# EAGLE design fc-nes (EAGLE 6.4)

## Sheet 1 of 3
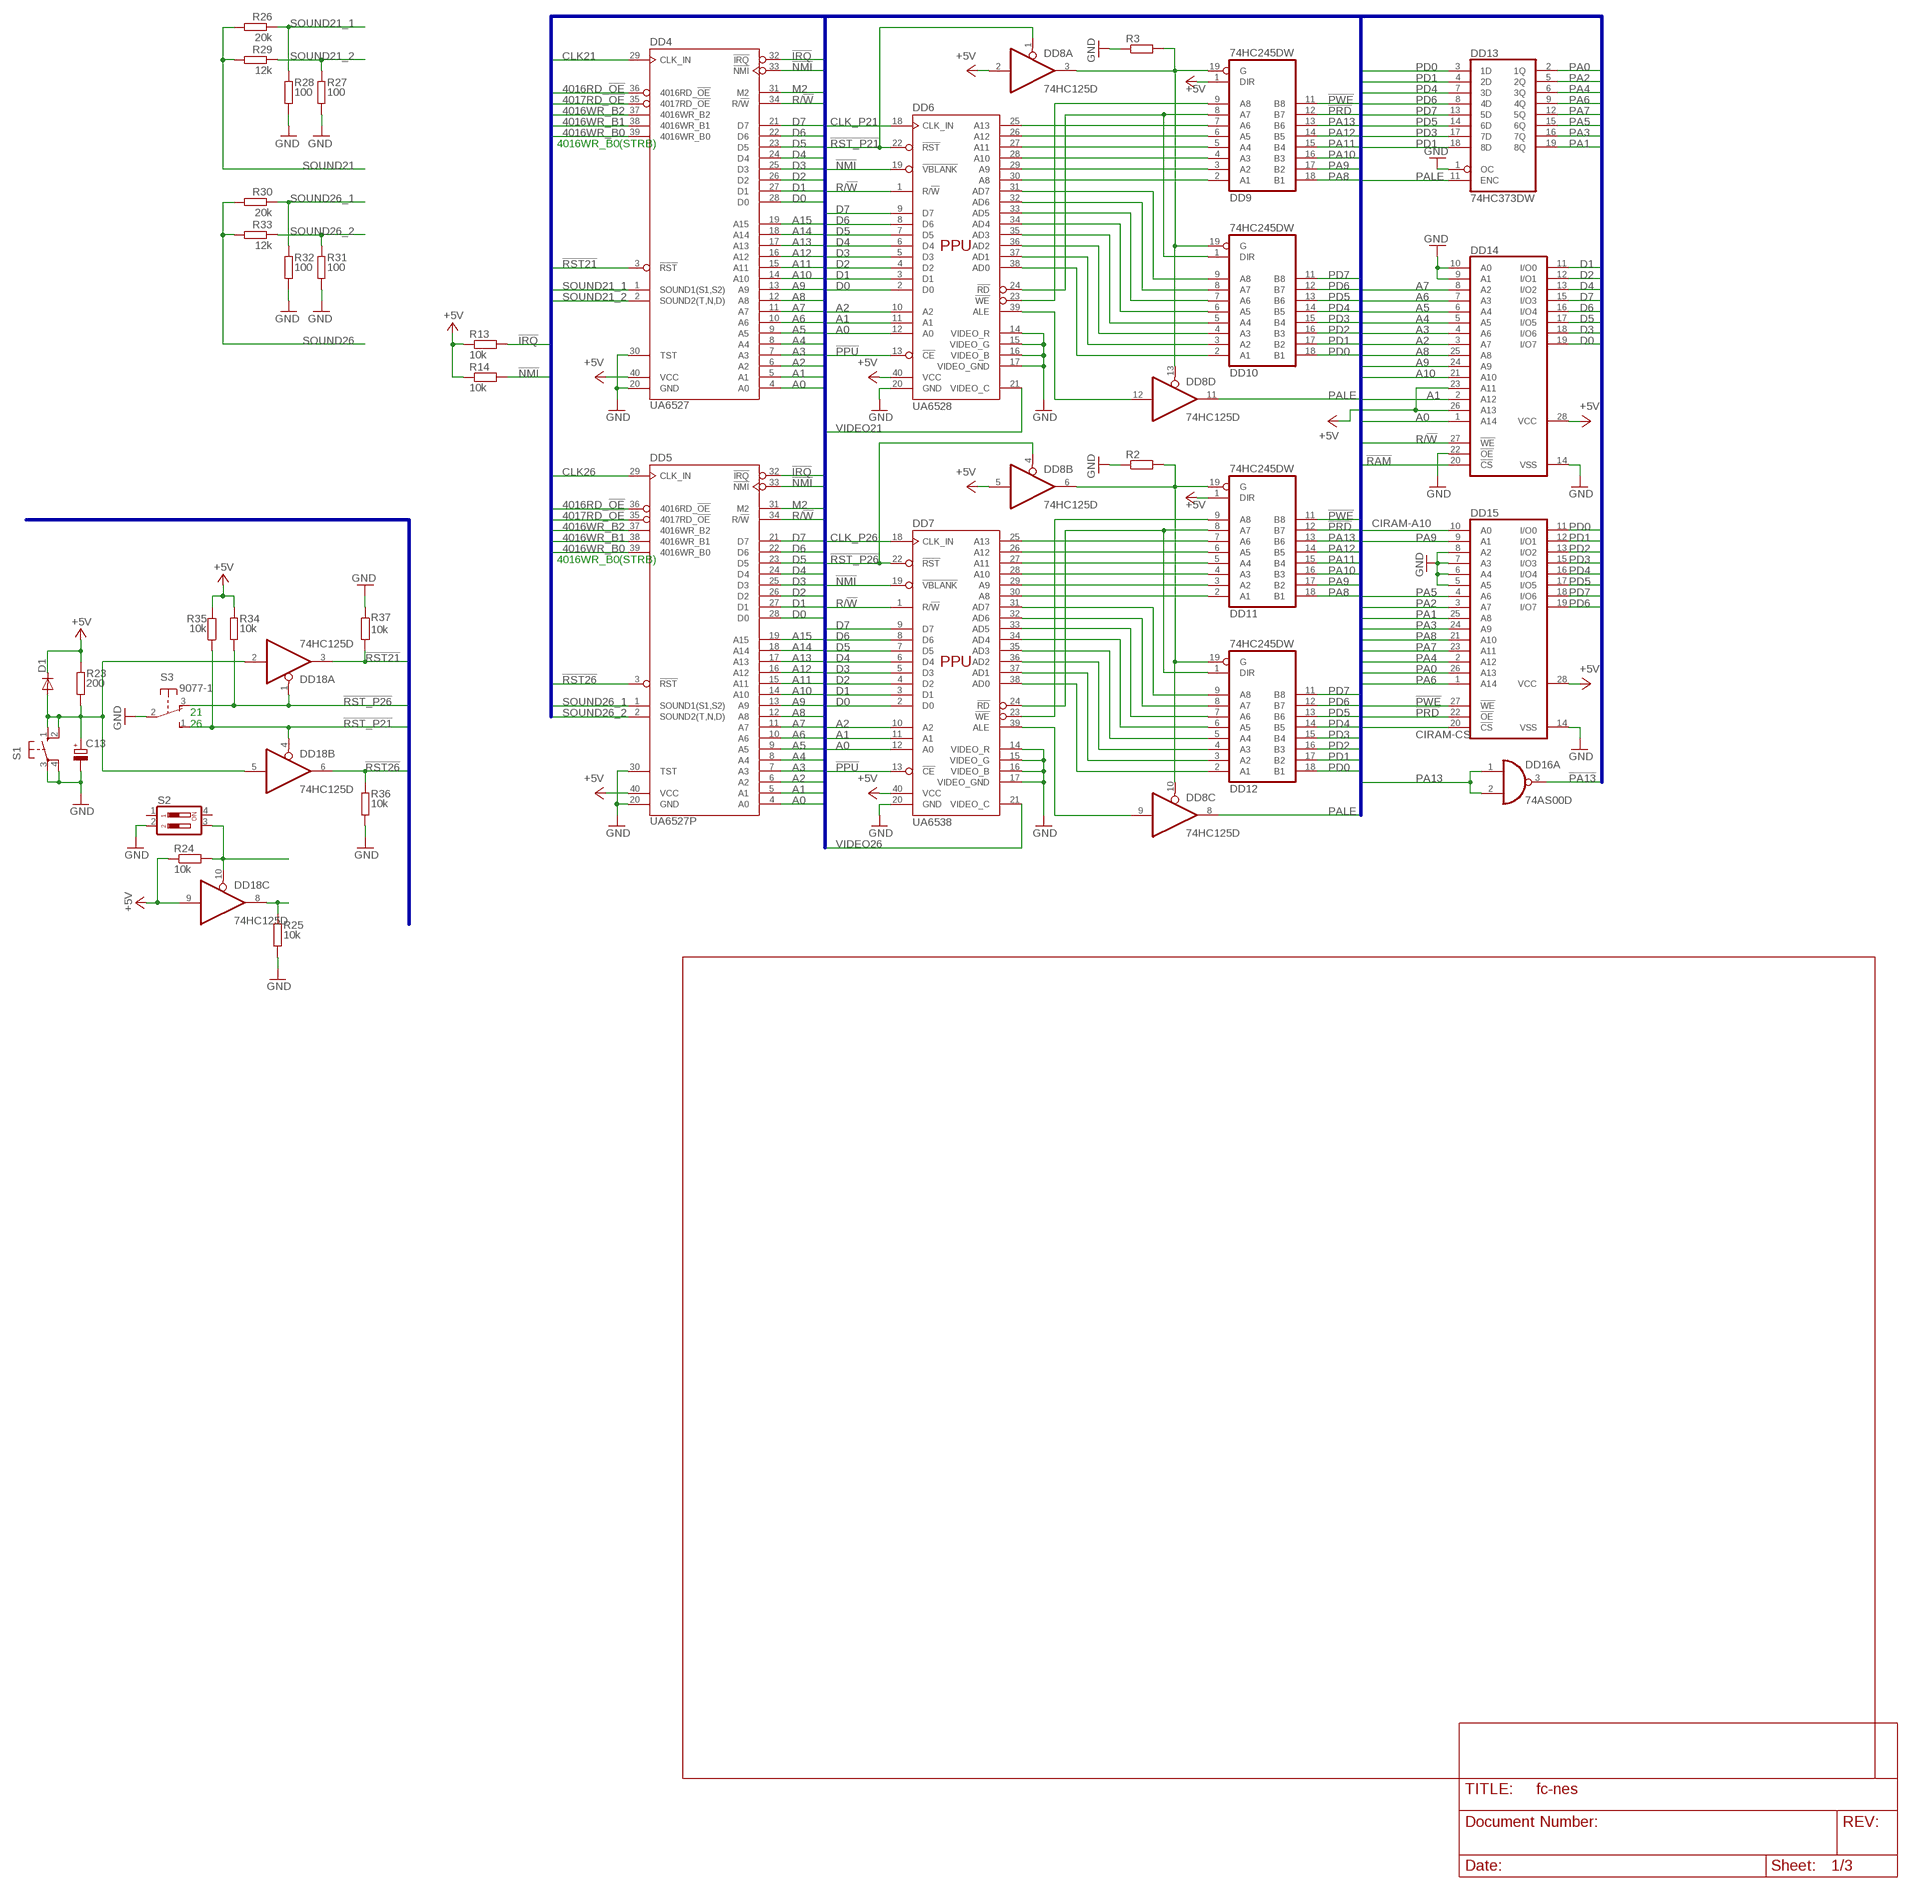
[diagram p0: schematic, sheet 1]

### Parts
C13  CPOL-EUSMCA  [SMC_A]
D1  DIODE-SOD80C  [SOD80C]
DD4  UA6527  [DIL40]
DD5  UA6527P  UA6527  [DIL40]
DD6  UA6528  UA6538  [DIL40]
DD7  UA6538  [DIL40]
DD8  74HC125D  [SO14]
DD9  74HC245DW  [SO20W]
DD10  74HC245DW  [SO20W]
DD11  74HC245DW  [SO20W]
DD12  74HC245DW  [SO20W]
DD13  74HC373DW  [SO20W]
DD14  62256S  [DIL28-6S]
DD15  62256S  [DIL28-6S]
DD16  74AS00D  [SO14]
DD18  74HC125D  [SO14]
R2  R-EU_M0805  [M0805]
R3  R-EU_M0805  [M0805]
R13  10k  R-EU_M0805  [M0805]
R14  10k  R-EU_M0805  [M0805]
R23  200  R-EU_M0805  [M0805]
R24  10k  R-EU_M0805  [M0805]
R25  10k  R-EU_M0805  [M0805]
R26  20k  R-EU_M0805  [M0805]
R27  100  R-EU_M0805  [M0805]
R28  100  R-EU_M0805  [M0805]
R29  12k  R-EU_M0805  [M0805]
R30  20k  R-EU_M0805  [M0805]
R31  100  R-EU_M0805  [M0805]
R32  100  R-EU_M0805  [M0805]
R33  12k  R-EU_M0805  [M0805]
R34  10k  R-EU_M0805  [M0805]
R35  10k  R-EU_M0805  [M0805]
R36  10k  R-EU_M0805  [M0805]
R37  10k  R-EU_M0805  [M0805]
S1  10-XX  [B3F-10XX]
S2  DIP02YL  [DIP02YL]
S3  9077-1  [9077-1]

### Nets
4016RD_!OE: DD4.36(4016RD_!OE) DD5.36(4016RD_!OE) ; also sheet 2
4016WR_B0: DD4.39(4016WR_B0) DD5.39(4016WR_B0) ; also sheet 2
4016WR_B1: DD4.38(4016WR_B1) DD5.38(4016WR_B1) ; also sheet 2
4016WR_B2: DD4.37(4016WR_B2) DD5.37(4016WR_B2) ; also sheet 2
4017RD_!OE: DD4.35(4017RD_!OE) DD5.35(4017RD_!OE) ; also sheet 2
!IRQ: DD4.32(!IRQ) DD5.32(!IRQ) R13.2 ; also sheet 2
!NMI: DD4.33(!NMI) DD5.33(!NMI) DD6.19(!VBLANK) DD7.19(!VBLANK) R14.2
!PA13: DD16.3(A:O) ; also sheet 2
!PPU: DD6.13(!CE) DD7.13(!CE) ; also sheet 2
!PRD: DD9.12(B7) DD11.12(B7) DD15.22(!OE) ; also sheet 2
!PWE: DD9.11(B8) DD11.11(B8) DD15.27(!WE) ; also sheet 2
!RAM: DD14.20(!CS) ; also sheet 2
!RST21: DD4.3(!RST) DD18.3(A:O) R37.2
!RST26: DD5.3(!RST) DD18.6(B:O) R36.2
!RST_P21: DD6.22(!RST) DD8.1(A:OE) DD18.4(B:OE) R35.1 S3.1(S)
!RST_P26: DD7.22(!RST) DD8.4(B:OE) DD18.1(A:OE) R34.1 S3.3(O)
+5V: D1.C DD4.40(VCC) DD5.40(VCC) DD6.40(VCC) DD7.40(VCC) DD8.2(A:I) DD8.5(B:I) DD9.1(DIR) DD11.1(DIR) DD14.23(A11) DD14.26(A13) DD14.28(VCC) DD15.28(VCC) DD18.9(C:I) R13.1 R14.1 R23.2 R24.1 R34.2 R35.2 ; also sheet 2,3
A0: DD4.4(A0) DD5.4(A0) DD6.12(A0) DD7.12(A0) DD14.1(A14) ; also sheet 2
A1: DD4.5(A1) DD5.5(A1) DD6.11(A1) DD7.11(A1) DD14.2(A12) ; also sheet 2
A2: DD4.6(A2) DD5.6(A2) DD6.10(A2) DD7.10(A2) DD14.3(A7) ; also sheet 2
A3: DD4.7(A3) DD5.7(A3) DD14.4(A6) ; also sheet 2
A4: DD4.8(A4) DD5.8(A4) DD14.5(A5) ; also sheet 2
A5: DD4.9(A5) DD5.9(A5) DD14.6(A4) ; also sheet 2
A6: DD4.10(A6) DD5.10(A6) DD14.7(A3) ; also sheet 2
A7: DD4.11(A7) DD5.11(A7) DD14.8(A2) ; also sheet 2
A8: DD4.12(A8) DD5.12(A8) DD14.25(A8) ; also sheet 2
A9: DD4.13(A9) DD5.13(A9) DD14.24(A9) ; also sheet 2
A10: DD4.14(A10) DD5.14(A10) DD14.21(A10) ; also sheet 2
A11: DD4.15(A11) DD5.15(A11) ; also sheet 2
A12: DD4.16(A12) DD5.16(A12) ; also sheet 2
A13: DD4.17(A13) DD5.17(A13) ; also sheet 2
A14: DD4.18(A14) DD5.18(A14) ; also sheet 2
A15: DD4.19(A15) DD5.19(A15) ; also sheet 2
CIRAM-A10: DD15.10(A0) ; also sheet 2
CIRAM-CS: DD15.20(!CS) ; also sheet 2
CLK21: DD4.29(CLK_IN) ; also sheet 3
CLK26: DD5.29(CLK_IN) ; also sheet 3
CLK_P21: DD6.18(CLK_IN) ; also sheet 3
CLK_P26: DD7.18(CLK_IN) ; also sheet 3
D0: DD4.28(D0) DD5.28(D0) DD6.2(D0) DD7.2(D0) DD14.19(I/O7) ; also sheet 2
D1: DD4.27(D1) DD5.27(D1) DD6.3(D1) DD7.3(D1) DD14.11(I/O0) ; also sheet 2
D2: DD4.26(D2) DD5.26(D2) DD6.4(D2) DD7.4(D2) DD14.12(I/O1) ; also sheet 2
D3: DD4.25(D3) DD5.25(D3) DD6.5(D3) DD7.5(D3) DD14.18(I/O6) ; also sheet 2
D4: DD4.24(D4) DD5.24(D4) DD6.6(D4) DD7.6(D4) DD14.13(I/O2) ; also sheet 2
D5: DD4.23(D5) DD5.23(D5) DD6.7(D5) DD7.7(D5) DD14.17(I/O5) ; also sheet 2
D6: DD4.22(D6) DD5.22(D6) DD6.8(D6) DD7.8(D6) DD14.16(I/O4) ; also sheet 2
D7: DD4.21(D7) DD5.21(D7) DD6.9(D7) DD7.9(D7) DD14.15(I/O3) ; also sheet 2
GND: C13.- DD4.20(GND) DD4.30(TST) DD5.20(GND) DD5.30(TST) DD6.14(VIDEO_R) DD6.15(VIDEO_G) DD6.16(VIDEO_B) DD6.17(VIDEO_GND) DD6.20(GND) DD7.14(VIDEO_R) DD7.15(VIDEO_G) DD7.16(VIDEO_B) DD7.17(VIDEO_GND) DD7.20(GND) DD13.1(OC) DD14.9(A1) DD14.10(A0) DD14.14(VSS) DD14.22(!OE) DD15.5(A5) DD15.6(A4) DD15.7(A3) DD15.8(A2) DD15.14(VSS) R2.1 R3.1 R25.1 R27.1 R28.1 R31.1 R32.1 R36.1 R37.1 S1.3(P) S1.4(P1) S2.2 S3.2(P) ; also sheet 2,3
M2: DD4.31(M2) DD5.31(M2) ; also sheet 2
N$1: DD6.23(!WE) DD9.9(A8)
N$2: DD6.24(!RD) DD9.8(A7) DD10.1(DIR)
N$3: DD6.25(A13) DD9.7(A6)
N$4: DD6.26(A12) DD9.6(A5)
N$5: DD6.27(A11) DD9.5(A4)
N$6: DD6.28(A10) DD9.4(A3)
N$7: DD6.29(A9) DD9.3(A2)
N$8: DD6.30(A8) DD9.2(A1)
N$9: DD6.31(AD7) DD10.9(A8)
N$10: DD6.32(AD6) DD10.8(A7)
N$11: DD6.33(AD5) DD10.7(A6)
N$12: DD6.34(AD4) DD10.6(A5)
N$13: DD6.35(AD3) DD10.5(A4)
N$14: DD6.36(AD2) DD10.4(A3)
N$15: DD6.37(AD1) DD10.3(A2)
N$16: DD6.38(AD0) DD10.2(A1)
N$17: DD8.3(A:O) DD8.13(D:OE) DD9.19(G) DD10.19(G) R3.2
N$18: DD6.39(ALE) DD8.12(D:I)
N$20: DD7.23(!WE) DD11.9(A8)
N$21: DD7.24(!RD) DD11.8(A7) DD12.1(DIR)
N$22: DD7.25(A13) DD11.7(A6)
N$23: DD7.26(A12) DD11.6(A5)
N$24: DD7.27(A11) DD11.5(A4)
N$25: DD7.28(A10) DD11.4(A3)
N$26: DD7.29(A9) DD11.3(A2)
N$27: DD7.30(A8) DD11.2(A1)
N$28: DD7.31(AD7) DD12.9(A8)
N$29: DD7.32(AD6) DD12.8(A7)
N$30: DD7.33(AD5) DD12.7(A6)
N$31: DD7.34(AD4) DD12.6(A5)
N$32: DD7.35(AD3) DD12.5(A4)
N$33: DD7.36(AD2) DD12.4(A3)
N$34: DD7.37(AD1) DD12.3(A2)
N$35: DD7.38(AD0) DD12.2(A1)
N$36: DD8.6(B:O) DD8.10(C:OE) DD11.19(G) DD12.19(G) R2.2
N$38: DD7.39(ALE) DD8.9(C:I)
N$48: C13.+ D1.A DD18.2(A:I) DD18.5(B:I) R23.1 S1.1(S) S1.2(S1)
N$50: DD18.10(C:OE) R24.2 S2.3
N$53: DD18.8(C:O) R25.2
PA0: DD13.2(1Q) DD15.26(A13) ; also sheet 2
PA1: DD13.19(8Q) DD15.25(A8) ; also sheet 2
PA2: DD13.5(2Q) DD15.3(A7) ; also sheet 2
PA3: DD13.16(7Q) DD15.24(A9) ; also sheet 2
PA4: DD13.6(3Q) DD15.2(A12) ; also sheet 2
PA5: DD13.15(6Q) DD15.4(A6) ; also sheet 2
PA6: DD13.9(4Q) DD15.1(A14) ; also sheet 2
PA7: DD13.12(5Q) DD15.23(A11) ; also sheet 2
PA8: DD9.18(B1) DD11.18(B1) DD15.21(A10) ; also sheet 2
PA9: DD9.17(B2) DD11.17(B2) DD15.9(A1) ; also sheet 2
PA10: DD9.16(B3) DD11.16(B3) ; also sheet 2
PA11: DD9.15(B4) DD11.15(B4) ; also sheet 2
PA12: DD9.14(B5) DD11.14(B5) ; also sheet 2
PA13: DD9.13(B6) DD11.13(B6) DD16.1(A:I0) DD16.2(A:I1) ; also sheet 2
PALE: DD8.8(C:O) DD8.11(D:O) DD13.11(ENC)
PD0: DD10.18(B1) DD12.18(B1) DD13.3(1D) DD15.11(I/O0) ; also sheet 2
PD1: DD10.17(B2) DD12.17(B2) DD13.4(2D) DD13.18(8D) DD15.12(I/O1) ; also sheet 2
PD2: DD10.16(B3) DD12.16(B3) DD15.13(I/O2) ; also sheet 2
PD3: DD10.15(B4) DD12.15(B4) DD13.17(7D) DD15.15(I/O3) ; also sheet 2
PD4: DD10.14(B5) DD12.14(B5) DD13.7(3D) DD15.16(I/O4) ; also sheet 2
PD5: DD10.13(B6) DD12.13(B6) DD13.14(6D) DD15.17(I/O5) ; also sheet 2
PD6: DD10.12(B7) DD12.12(B7) DD13.8(4D) DD15.19(I/O7) ; also sheet 2
PD7: DD10.11(B8) DD12.11(B8) DD13.13(5D) DD15.18(I/O6) ; also sheet 2
R/!W: DD4.34(R/!W) DD5.34(R/!W) DD6.1(R/!W) DD7.1(R/!W) DD14.27(!WE) ; also sheet 2
SOUND21: R26.2 R29.2
SOUND21_1: DD4.1(SOUND1(S1,S2)) R26.1 R28.2
SOUND21_2: DD4.2(SOUND2(T,N,D)) R27.2 R29.1
SOUND26: R30.2 R33.2
SOUND26_1: DD5.1(SOUND1(S1,S2)) R30.1 R32.2
SOUND26_2: DD5.2(SOUND2(T,N,D)) R31.2 R33.1
VIDEO21: DD6.21(VIDEO_C)
VIDEO26: DD7.21(VIDEO_C)
Unconnected: DD16.4(B:I0) DD16.5(B:I1) DD16.6(B:O) DD16.8(C:O) DD16.9(C:I0) DD16.10(C:I1) DD16.11(D:O) DD16.12(D:I0) DD16.13(D:I1) DD18.11(D:O) DD18.12(D:I) DD18.13(D:OE) S2.1 S2.4

### Buses
A[0..15],D[0..7],PA[0..13],!PA13,PD[0..7],CLK21,CLK26,CLK_P21,CLK_P26,CIRAM-A10,CIRAM-CS,!IRQ,M2,!NMI,PALE,!PPU,!PRD,!PWE,!RAM,!ROMSEL,R/!W,!RST21,!RST26,!RST_P21,!RST_P26,4016CUP,4016RD_!OE,4016WR_B[0..2],4016RD_D[0..4],4017CUP,4017RD_!OE,4017RD_D[0..4],VIDEO21,VIDEO26,MIC,SND_IN,SND_OUT,SOUND21_[1..2],SOUND21,SOUND26_[1..2],SOUND26

### Notes on the sheet
- 4016WR_B0(STRB)
- 4016WR_B0(STRB)
- 21
  26

## Sheet 2 of 3
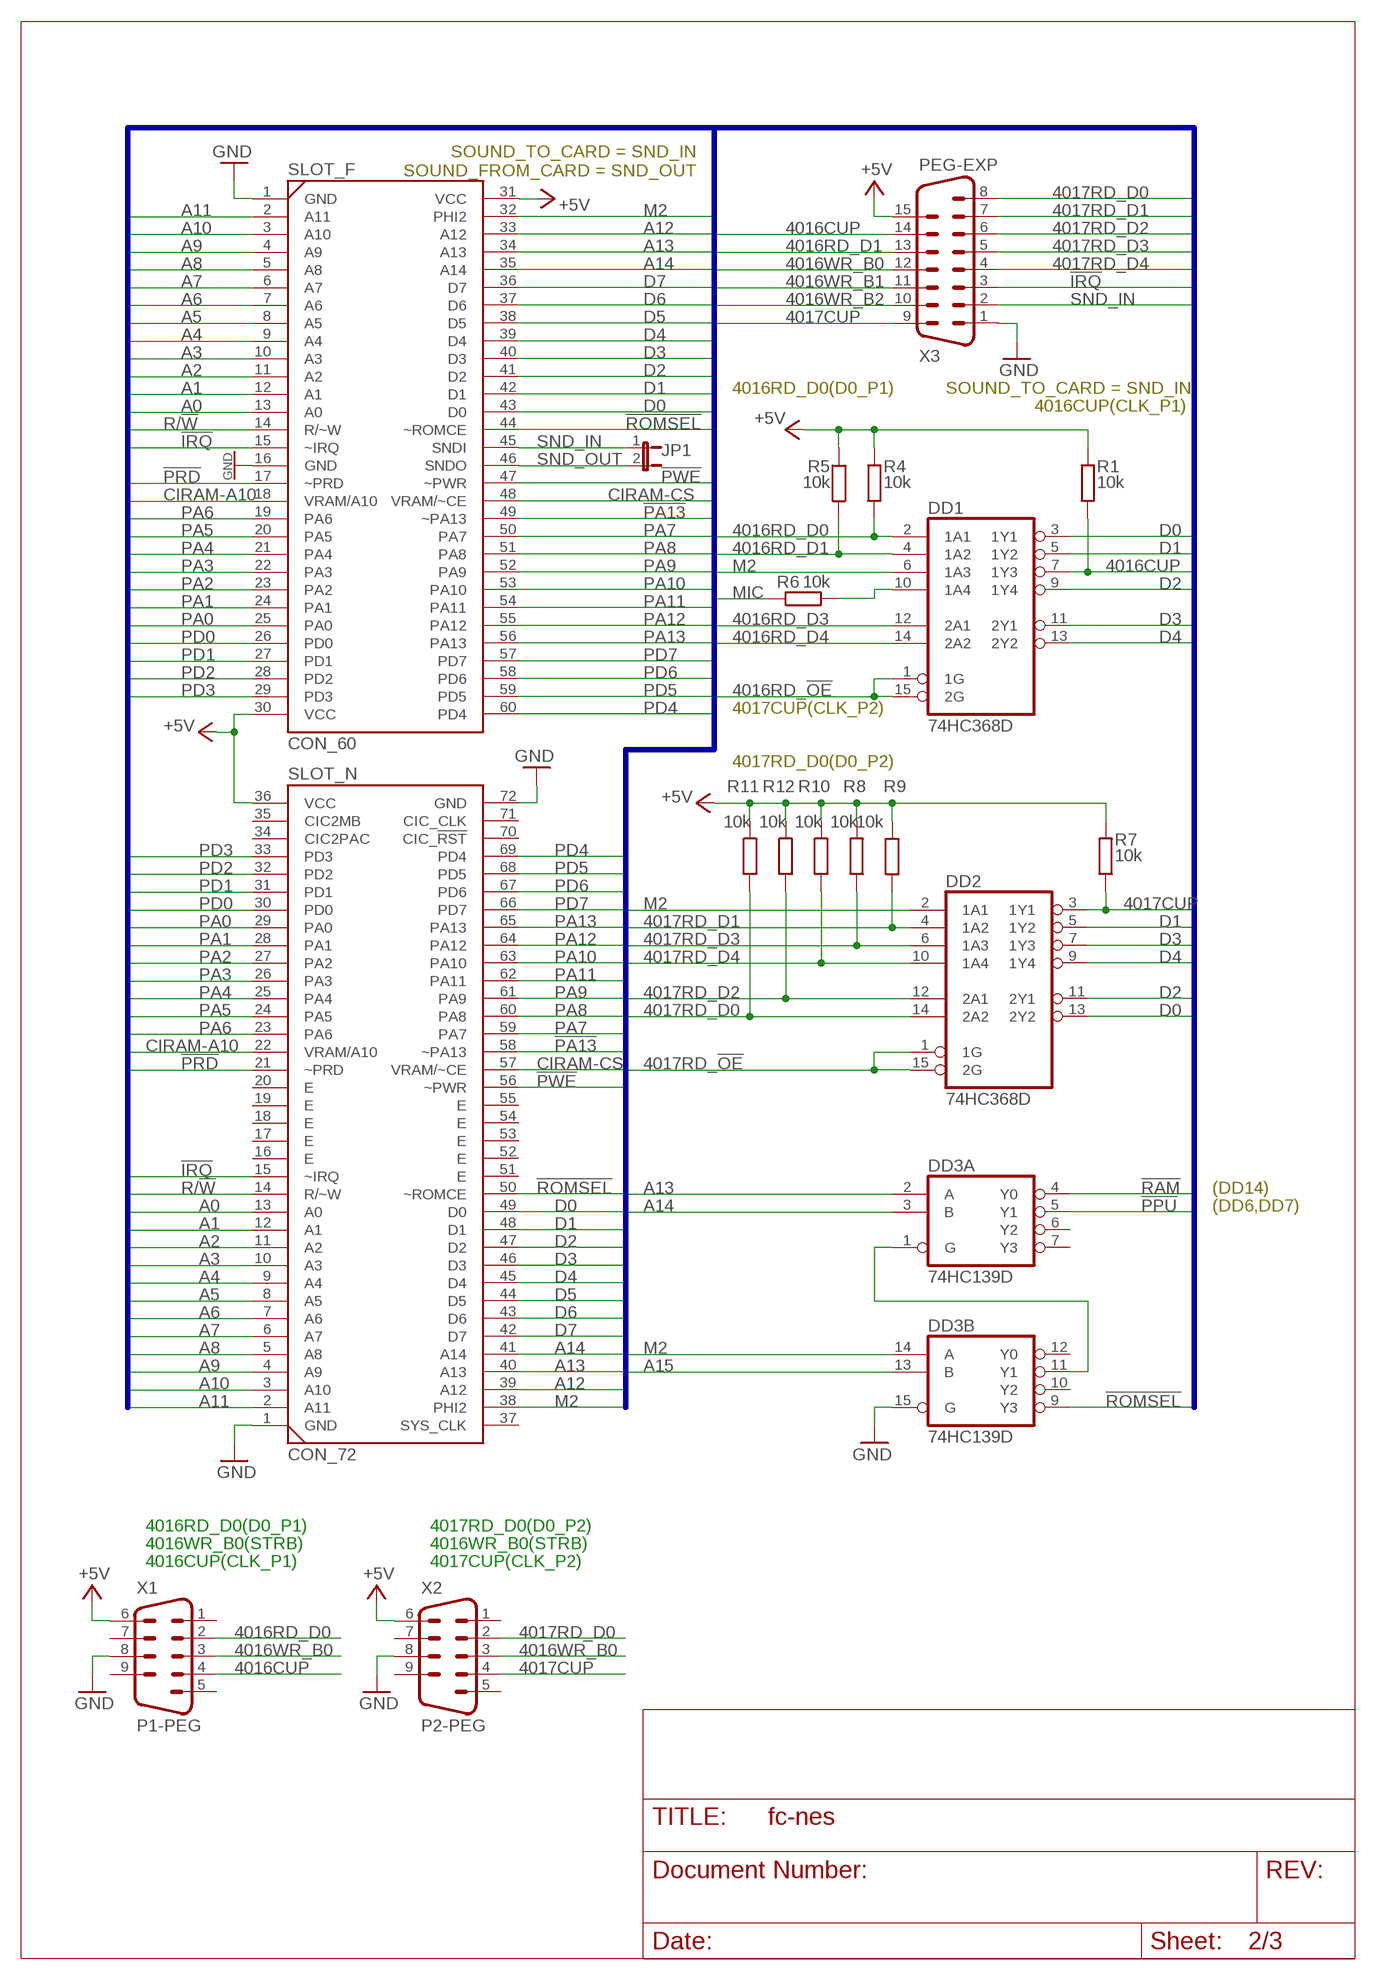
[diagram p1: schematic, sheet 2]

### Parts
DD1  74HC368D  [SO16]
DD2  74HC368D  [SO16]
DD3  74HC139D  [SO16]
JP1  JP1E  [JP1]
R1  10k  R-EU_M0805  [M0805]
R4  10k  R-EU_M0805  [M0805]
R5  10k  R-EU_M0805  [M0805]
R6  10k  R-EU_M0805  [M0805]
R7  10k  R-EU_M0805  [M0805]
R8  10k  R-EU_M0805  [M0805]
R9  10k  R-EU_M0805  [M0805]
R10  10k  R-EU_M0805  [M0805]
R11  10k  R-EU_M0805  [M0805]
R12  10k  R-EU_M0805  [M0805]
SLOT_F  CON_60  [CON_60]
SLOT_N  CON_72  [CON_72]
X1  P1-PEG  M09HP  [M09HP]
X2  P2-PEG  M09HP  [M09HP]
X3  PEG-EXP  M15HP  [M15HP]

### Nets
4016CUP: DD1.7(1Y3) R1.1 X1.4 X3.14
4016RD_!OE: DD1.1(1G) DD1.15(2G) ; also sheet 1
4016RD_D0: DD1.2(1A1) R4.1 X1.2
4016RD_D1: DD1.4(1A2) R5.1 X3.13
4016RD_D3: DD1.12(2A1)
4016RD_D4: DD1.14(2A2)
4016WR_B0: X1.3 X2.3 X3.12 ; also sheet 1
4016WR_B1: X3.11 ; also sheet 1
4016WR_B2: X3.10 ; also sheet 1
4017CUP: DD2.3(1Y1) R7.1 X2.4 X3.9
4017RD_!OE: DD2.1(1G) DD2.15(2G) ; also sheet 1
4017RD_D0: DD2.14(2A2) R11.2 X2.2 X3.8
4017RD_D1: DD2.4(1A2) R9.1 X3.7
4017RD_D2: DD2.12(2A1) R12.2 X3.6
4017RD_D3: DD2.6(1A3) R8.1 X3.5
4017RD_D4: DD2.10(1A4) R10.2 X3.4
!IRQ: SLOT_F.15(~IRQ) SLOT_N.15(~IRQ) X3.3 ; also sheet 1
!PA13: SLOT_F.49(~PA13) SLOT_N.58(~PA13) ; also sheet 1
!PPU: DD3.5(A:Y1) ; also sheet 1
!PRD: SLOT_F.17(~PRD) SLOT_N.21(~PRD) ; also sheet 1
!PWE: SLOT_F.47(~PWR) SLOT_N.56(~PWR) ; also sheet 1
!RAM: DD3.4(A:Y0) ; also sheet 1
!ROMSEL: DD3.9(B:Y3) SLOT_F.44(~ROMCE) SLOT_N.50(~ROMCE)
+5V: R1.2 R4.2 R5.2 R7.2 R8.2 R9.2 R10.1 R11.1 R12.1 SLOT_F.30(VCC) SLOT_F.31(VCC) SLOT_N.36(VCC) X1.6 X2.6 X3.15 ; also sheet 1,3
A0: SLOT_F.13(A0) SLOT_N.13(A0) ; also sheet 1
A1: SLOT_F.12(A1) SLOT_N.12(A1) ; also sheet 1
A2: SLOT_F.11(A2) SLOT_N.11(A2) ; also sheet 1
A3: SLOT_F.10(A3) SLOT_N.10(A3) ; also sheet 1
A4: SLOT_F.9(A4) SLOT_N.9(A4) ; also sheet 1
A5: SLOT_F.8(A5) SLOT_N.8(A5) ; also sheet 1
A6: SLOT_F.7(A6) SLOT_N.7(A6) ; also sheet 1
A7: SLOT_F.6(A7) SLOT_N.6(A7) ; also sheet 1
A8: SLOT_F.5(A8) SLOT_N.5(A8) ; also sheet 1
A9: SLOT_F.4(A9) SLOT_N.4(A9) ; also sheet 1
A10: SLOT_F.3(A10) SLOT_N.3(A10) ; also sheet 1
A11: SLOT_F.2(A11) SLOT_N.2(A11) ; also sheet 1
A12: SLOT_F.33(A12) SLOT_N.39(A12) ; also sheet 1
A13: DD3.2(A:A) SLOT_F.34(A13) SLOT_N.40(A13) ; also sheet 1
A14: DD3.3(A:B) SLOT_F.35(A14) SLOT_N.41(A14) ; also sheet 1
A15: DD3.13(B:B) ; also sheet 1
CIRAM-A10: SLOT_F.18(VRAM/A10) SLOT_N.22(VRAM/A10) ; also sheet 1
CIRAM-CS: SLOT_F.48(VRAM/~CE) SLOT_N.57(VRAM/~CE) ; also sheet 1
D0: DD1.3(1Y1) DD2.13(2Y2) SLOT_F.43(D0) SLOT_N.49(D0) ; also sheet 1
D1: DD1.5(1Y2) DD2.5(1Y2) SLOT_F.42(D1) SLOT_N.48(D1) ; also sheet 1
D2: DD1.9(1Y4) DD2.11(2Y1) SLOT_F.41(D2) SLOT_N.47(D2) ; also sheet 1
D3: DD1.11(2Y1) DD2.7(1Y3) SLOT_F.40(D3) SLOT_N.46(D3) ; also sheet 1
D4: DD1.13(2Y2) DD2.9(1Y4) SLOT_F.39(D4) SLOT_N.45(D4) ; also sheet 1
D5: SLOT_F.38(D5) SLOT_N.44(D5) ; also sheet 1
D6: SLOT_F.37(D6) SLOT_N.43(D6) ; also sheet 1
D7: SLOT_F.36(D7) SLOT_N.42(D7) ; also sheet 1
GND: DD3.15(B:G) SLOT_F.1(GND) SLOT_F.16(GND) SLOT_N.1(GND) SLOT_N.72(GND) X1.8 X2.8 X3.1 ; also sheet 1,3
M2: DD1.6(1A3) DD2.2(1A1) DD3.14(B:A) SLOT_F.32(PHI2) SLOT_N.38(PHI2) ; also sheet 1
MIC: R6.1
N$37: DD3.1(A:G) DD3.11(B:Y1)
N$40: DD1.10(1A4) R6.2
PA0: SLOT_F.25(PA0) SLOT_N.29(PA0) ; also sheet 1
PA1: SLOT_F.24(PA1) SLOT_N.28(PA1) ; also sheet 1
PA2: SLOT_F.23(PA2) SLOT_N.27(PA2) ; also sheet 1
PA3: SLOT_F.22(PA3) SLOT_N.26(PA3) ; also sheet 1
PA4: SLOT_F.21(PA4) SLOT_N.25(PA4) ; also sheet 1
PA5: SLOT_F.20(PA5) SLOT_N.24(PA5) ; also sheet 1
PA6: SLOT_F.19(PA6) SLOT_N.23(PA6) ; also sheet 1
PA7: SLOT_F.50(PA7) SLOT_N.59(PA7) ; also sheet 1
PA8: SLOT_F.51(PA8) SLOT_N.60(PA8) ; also sheet 1
PA9: SLOT_F.52(PA9) SLOT_N.61(PA9) ; also sheet 1
PA10: SLOT_F.53(PA10) SLOT_N.63(PA10) ; also sheet 1
PA11: SLOT_F.54(PA11) SLOT_N.62(PA11) ; also sheet 1
PA12: SLOT_F.55(PA12) SLOT_N.64(PA12) ; also sheet 1
PA13: SLOT_F.56(PA13) SLOT_N.65(PA13) ; also sheet 1
PD0: SLOT_F.26(PD0) SLOT_N.30(PD0) ; also sheet 1
PD1: SLOT_F.27(PD1) SLOT_N.31(PD1) ; also sheet 1
PD2: SLOT_F.28(PD2) SLOT_N.32(PD2) ; also sheet 1
PD3: SLOT_F.29(PD3) SLOT_N.33(PD3) ; also sheet 1
PD4: SLOT_F.60(PD4) SLOT_N.69(PD4) ; also sheet 1
PD5: SLOT_F.59(PD5) SLOT_N.68(PD5) ; also sheet 1
PD6: SLOT_F.58(PD6) SLOT_N.67(PD6) ; also sheet 1
PD7: SLOT_F.57(PD7) SLOT_N.66(PD7) ; also sheet 1
R/!W: SLOT_F.14(R/~W) SLOT_N.14(R/~W) ; also sheet 1
SND_IN: JP1.1 SLOT_F.45(SNDI) X3.2
SND_OUT: JP1.2 SLOT_F.46(SNDO)
Unconnected: DD3.6(A:Y2) DD3.7(A:Y3) DD3.10(B:Y2) DD3.12(B:Y0) SLOT_N.16(E) SLOT_N.17(E) SLOT_N.18(E) SLOT_N.19(E) SLOT_N.20(E) SLOT_N.34(CIC2PAC) SLOT_N.35(CIC2MB) SLOT_N.37(SYS_CLK) SLOT_N.51(E) SLOT_N.52(E) SLOT_N.53(E) SLOT_N.54(E) SLOT_N.55(E) SLOT_N.70(CIC_!RST) SLOT_N.71(CIC_CLK) X1.1 X1.5 X1.7 X1.9 X2.1 X2.5 X2.7 X2.9

### Buses
A[0..15],D[0..7],PA[0..13],!PA13,PD[0..7],CLK21,CLK26,CLK_P21,CLK_P26,CIRAM-A10,CIRAM-CS,!IRQ,M2,!NMI,PALE,!PPU,!PRD,!PWE,!RAM,!ROMSEL,R/!W,!RST21,!RST26,!RST_P21,!RST_P26,4016CUP,4016RD_!OE,4016WR_B[0..2],4016RD_D[0..4],4017CUP,4017RD_!OE,4017RD_D[0..4],VIDEO21,VIDEO26,MIC,SND_IN,SND_OUT,SOUND21_[1..2],SOUND21,SOUND26_[1..2],SOUND26

### Notes on the sheet
- SOUND_TO_CARD = SND_IN
  SOUND_FROM_CARD = SND_OUT
- 4016RD_D0(D0_P1) | SOUND_TO_CARD = SND_IN
- 4016CUP(CLK_P1)
- 4017CUP(CLK_P2)
- 4017RD_D0(D0_P2)
- (DD14)
- (DD6,DD7)
- 4016RD_D0(D0_P1) | 4017RD_D0(D0_P2)
- 4016WR_B0(STRB) | 4016WR_B0(STRB)
- 4016CUP(CLK_P1) | 4017CUP(CLK_P2)

## Sheet 3 of 3
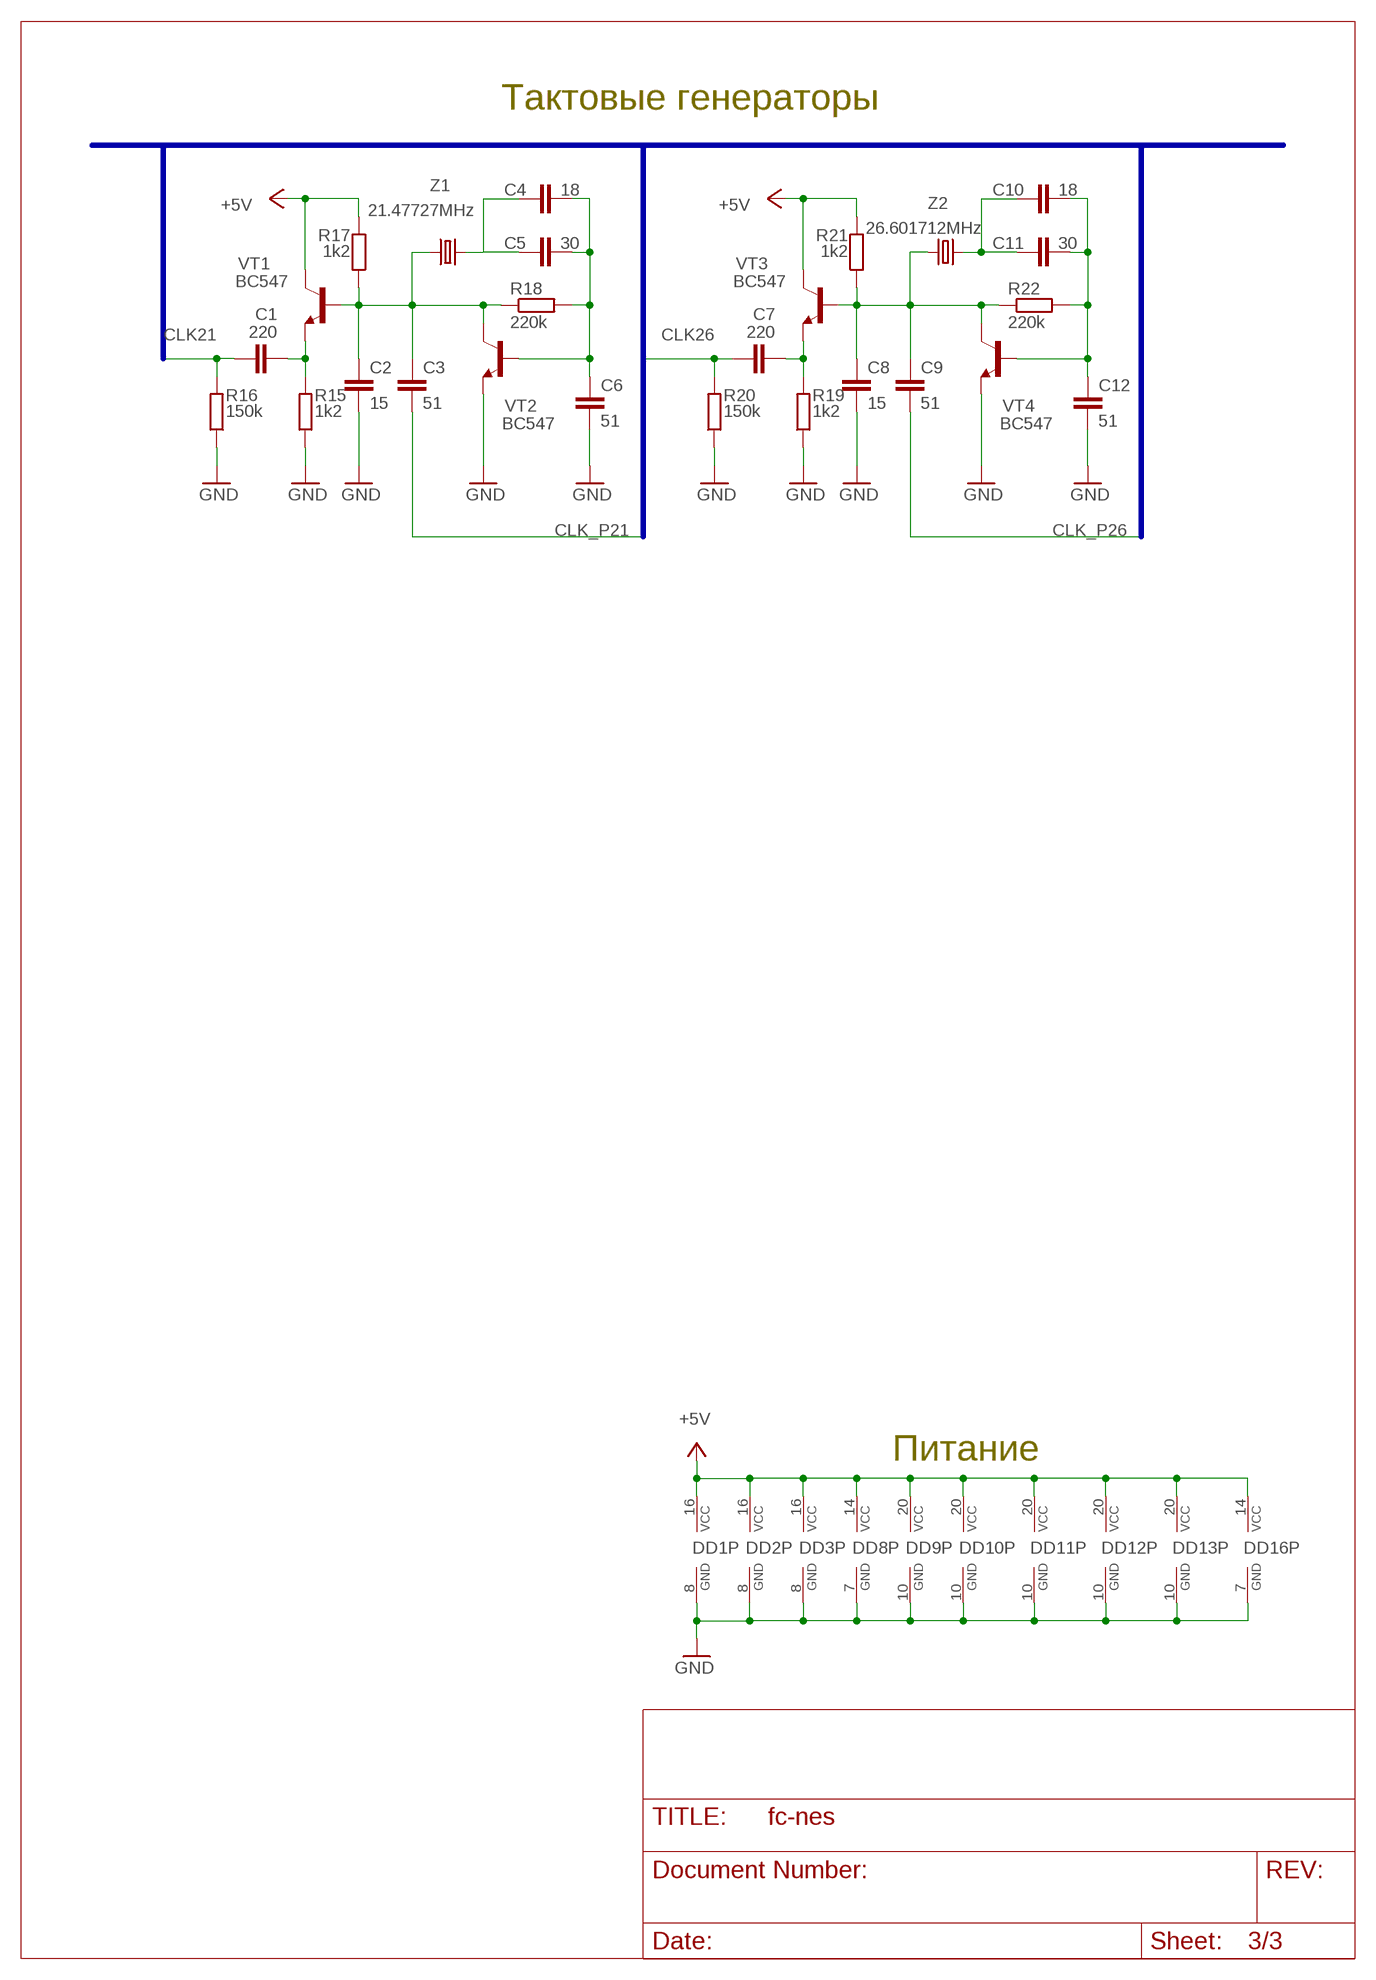
[diagram p2: schematic, sheet 3]

### Parts
C1  220  C-EUC0805  [C0805]
C2  15  C-EUC0805  [C0805]
C3  51  C-EUC0805  [C0805]
C4  18  C-EUC0805  [C0805]
C5  30  C-EUC0805  [C0805]
C6  51  C-EUC0805  [C0805]
C7  220  C-EUC0805  [C0805]
C8  15  C-EUC0805  [C0805]
C9  51  C-EUC0805  [C0805]
C10  18  C-EUC0805  [C0805]
C11  30  C-EUC0805  [C0805]
C12  51  C-EUC0805  [C0805]
R15  1k2  R-EU_M0805  [M0805]
R16  150k  R-EU_M0805  [M0805]
R17  1k2  R-EU_M0805  [M0805]
R18  220k  R-EU_M0805  [M0805]
R19  1k2  R-EU_M0805  [M0805]
R20  150k  R-EU_M0805  [M0805]
R21  1k2  R-EU_M0805  [M0805]
R22  220k  R-EU_M0805  [M0805]
VT1  BC547  BC547-NPN-TO92-CBE  [TO92-CBE]
VT2  BC547  BC547-NPN-TO92-CBE  [TO92-CBE]
VT3  BC547  BC547-NPN-TO92-CBE  [TO92-CBE]
VT4  BC547  BC547-NPN-TO92-CBE  [TO92-CBE]
Z1  21.47727MHz  CRYSTALHC49S  [HC49/S]
Z2  26.601712MHz  CRYSTALHC49S  [HC49/S]

### Nets
+5V: DD1.16(VCC) DD2.16(VCC) DD3.16(P:VCC) DD8.14(P:VCC) DD9.20(VCC) DD10.20(VCC) DD11.20(VCC) DD12.20(VCC) DD13.20(VCC) DD16.14(P:VCC) R17.2 R21.2 VT1.C VT3.C ; also sheet 1,2
CLK21: C1.1 R16.2 ; also sheet 1
CLK26: C7.1 R20.2 ; also sheet 1
CLK_P21: C3.2 ; also sheet 1
CLK_P26: C9.2 ; also sheet 1
GND: C2.2 C6.2 C8.2 C12.2 DD1.8(GND) DD2.8(GND) DD3.8(P:GND) DD8.7(P:GND) DD9.10(GND) DD10.10(GND) DD11.10(GND) DD12.10(GND) DD13.10(GND) DD16.7(P:GND) R15.1 R16.1 R19.1 R20.1 VT2.E VT4.E ; also sheet 1,2
N$19: C1.2 R15.2 VT1.E
N$39: C7.2 R19.2 VT3.E
N$41: C2.1 C3.1 R17.1 R18.1 VT1.B VT2.C Z1.1
N$42: C4.2 C5.2 C6.1 R18.2 VT2.B
N$43: C8.1 C9.1 R21.1 R22.1 VT3.B VT4.C Z2.1
N$44: C4.1 C5.1 Z1.2
N$45: C10.1 C11.1 Z2.2
N$46: C10.2 C11.2 C12.1 R22.2 VT4.B

### Buses
A[0..15],D[0..7],PA[0..13],!PA13,PD[0..7],CLK21,CLK26,CLK_P21,CLK_P26,CIRAM-A10,CIRAM-CS,!IRQ,M2,!NMI,PALE,!PPU,!PRD,!PWE,!RAM,!ROMSEL,R/!W,!RST21,!RST26,!RST_P21,!RST_P26,4016CUP,4016RD_!OE,4016WR_B[0..2],4016RD_D[0..4],4017CUP,4017RD_!OE,4017RD_D[0..4],VIDEO21,VIDEO26,MIC,SND_IN,SND_OUT,SOUND21_[1..2],SOUND21,SOUND26_[1..2],SOUND26

### Notes on the sheet
- Тактовые генераторы
- Питание

## Power pins joined to a net without a drawn wire
GND: DD18.7(P:GND)
VCC: DD18.14(P:VCC)

## Library data of the parts
C1-C12 = rcl:C-EU: CAPACITOR, European symbol
C13 = rcl:CPOL-EU: POLARIZED CAPACITOR, European symbol
D1 = diode:DIODE-: DIODE
DD1 DD2 = 74xx-eu:74*368: Hex BUS DRIVER, 3-state
DD3 = 74xx-eu:74*139: Dual 2-line to 4-line DECODER/DEMULTIPLEXER
DD4 DD5 = fc-nes:UA6527
DD6 DD7 = fc-nes:UA6538: RS2 - RS0 - komenda od CPU D0 - D7 - dane od/do CPU
DD8 DD18 = 74xx-eu:74*125: Quad bus BUFFER, 3-state
DD9-DD12 = 74xx-eu:74*245: Octal BUS TRANSCEIVER, 3-state
DD13 = 74xx-eu:74*373: Octal D type transparent LATCH, edge triggered
DD14 DD15 = fc-nes:62256: MEMORY
DD16 = 74xx-eu:74*00: Quad 2-input NAND gate
JP1 = jumper:JP1E: JUMPER
R1-R37 = rcl:R-EU_: RESISTOR, European symbol
S1 = switch-omron:10-XX: OMRON SWITCH; MPN: B3F-1000; OC_FARNELL: 176432; OC_NEWARK: 36M3542
S2 = switch-dil:DIP02YL: DIL/CODE SWITCH; OC_FARNELL: unknown; OC_NEWARK: unknown
S3 = switch-misc:9077-1: MARQUARDT SWITCH 9077.0100 Distributor: Buerklin <https://www.buerklin.com/default.asp?event=ShowArtikel%2812G2820%29&l=d&jump=ArtNr_12G2820>
SLOT_F = con_nes:CON_60
SLOT_N = fc-nes:CON_72
VT1-VT4 = transistor:*-NPN-: NPN Transistror BF959 corrected 2008.03.06
X1 X2 = con-subd:M09: SUB-D; OC_FARNELL: unknown; OC_NEWARK: unknown
X3 = con-subd:M15: SUB-D; OC_FARNELL: unknown; OC_NEWARK: unknown
Z1 Z2 = crystal:CRYSTAL: CRYSTAL; OC_FARNELL: 1667008; OC_NEWARK: unknown

## Board
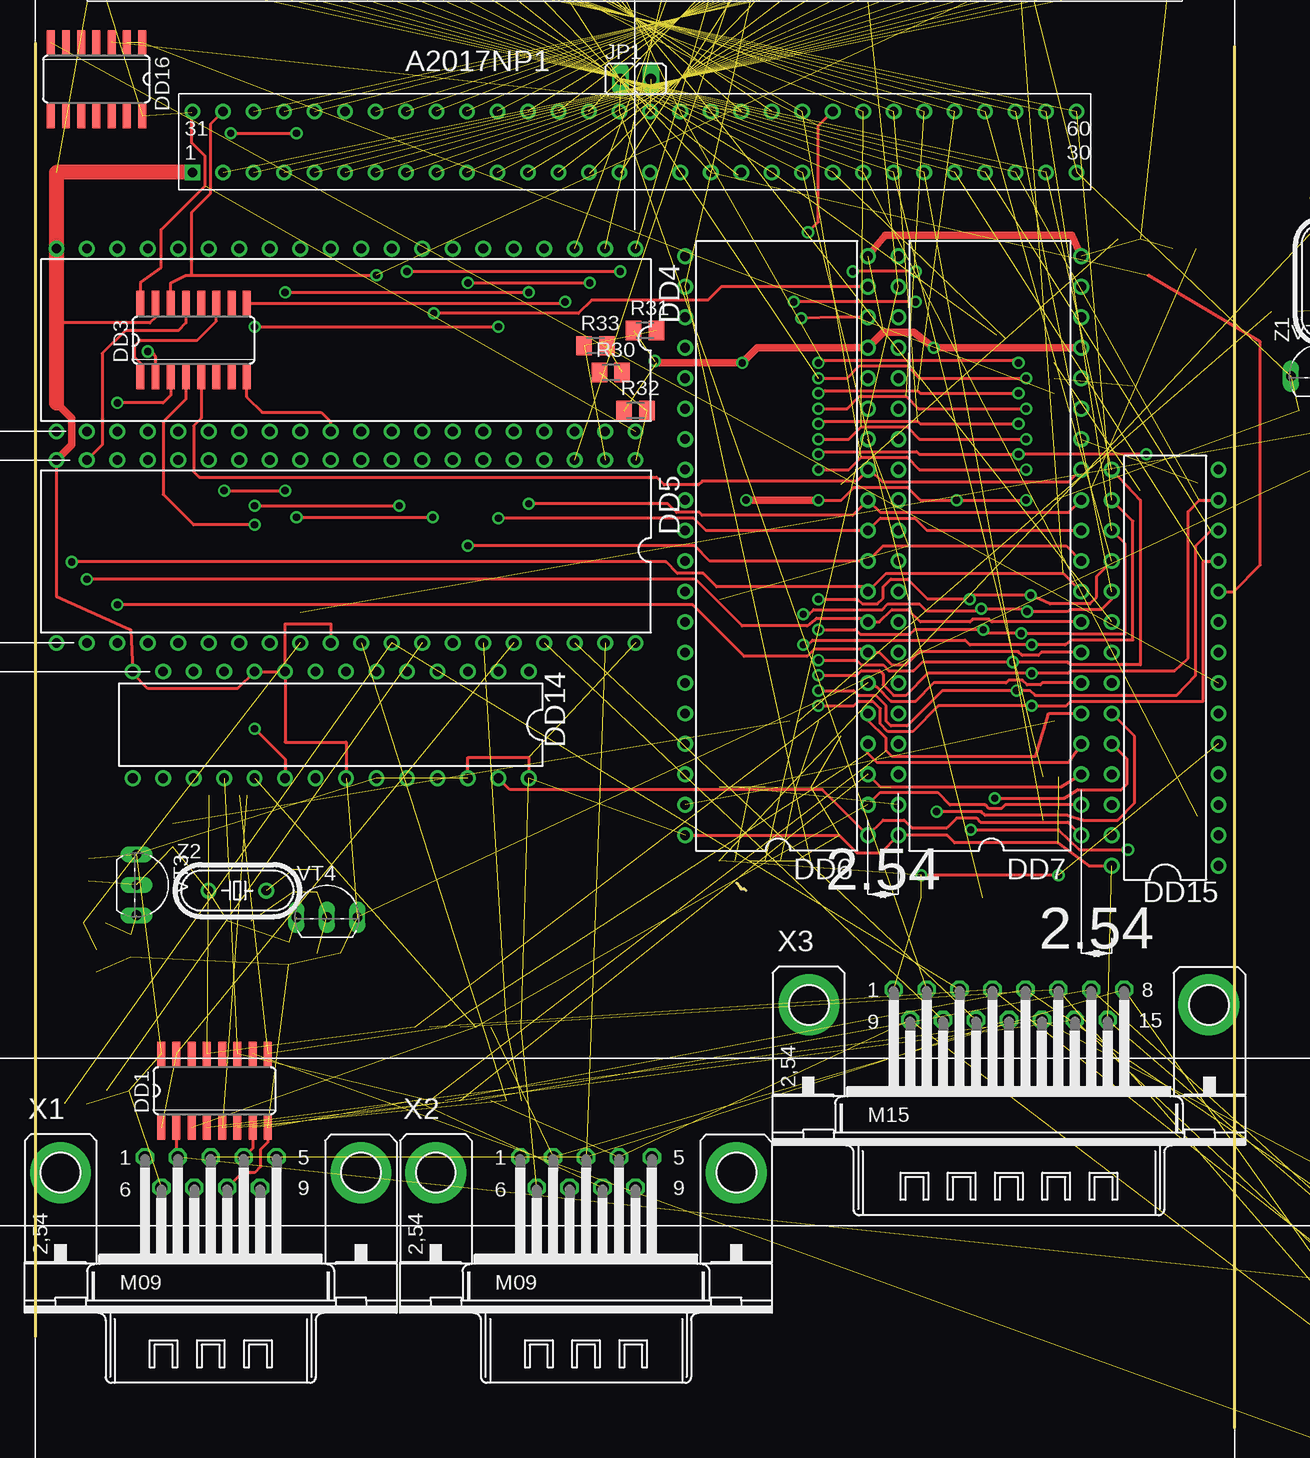
[diagram p3: board, top side]
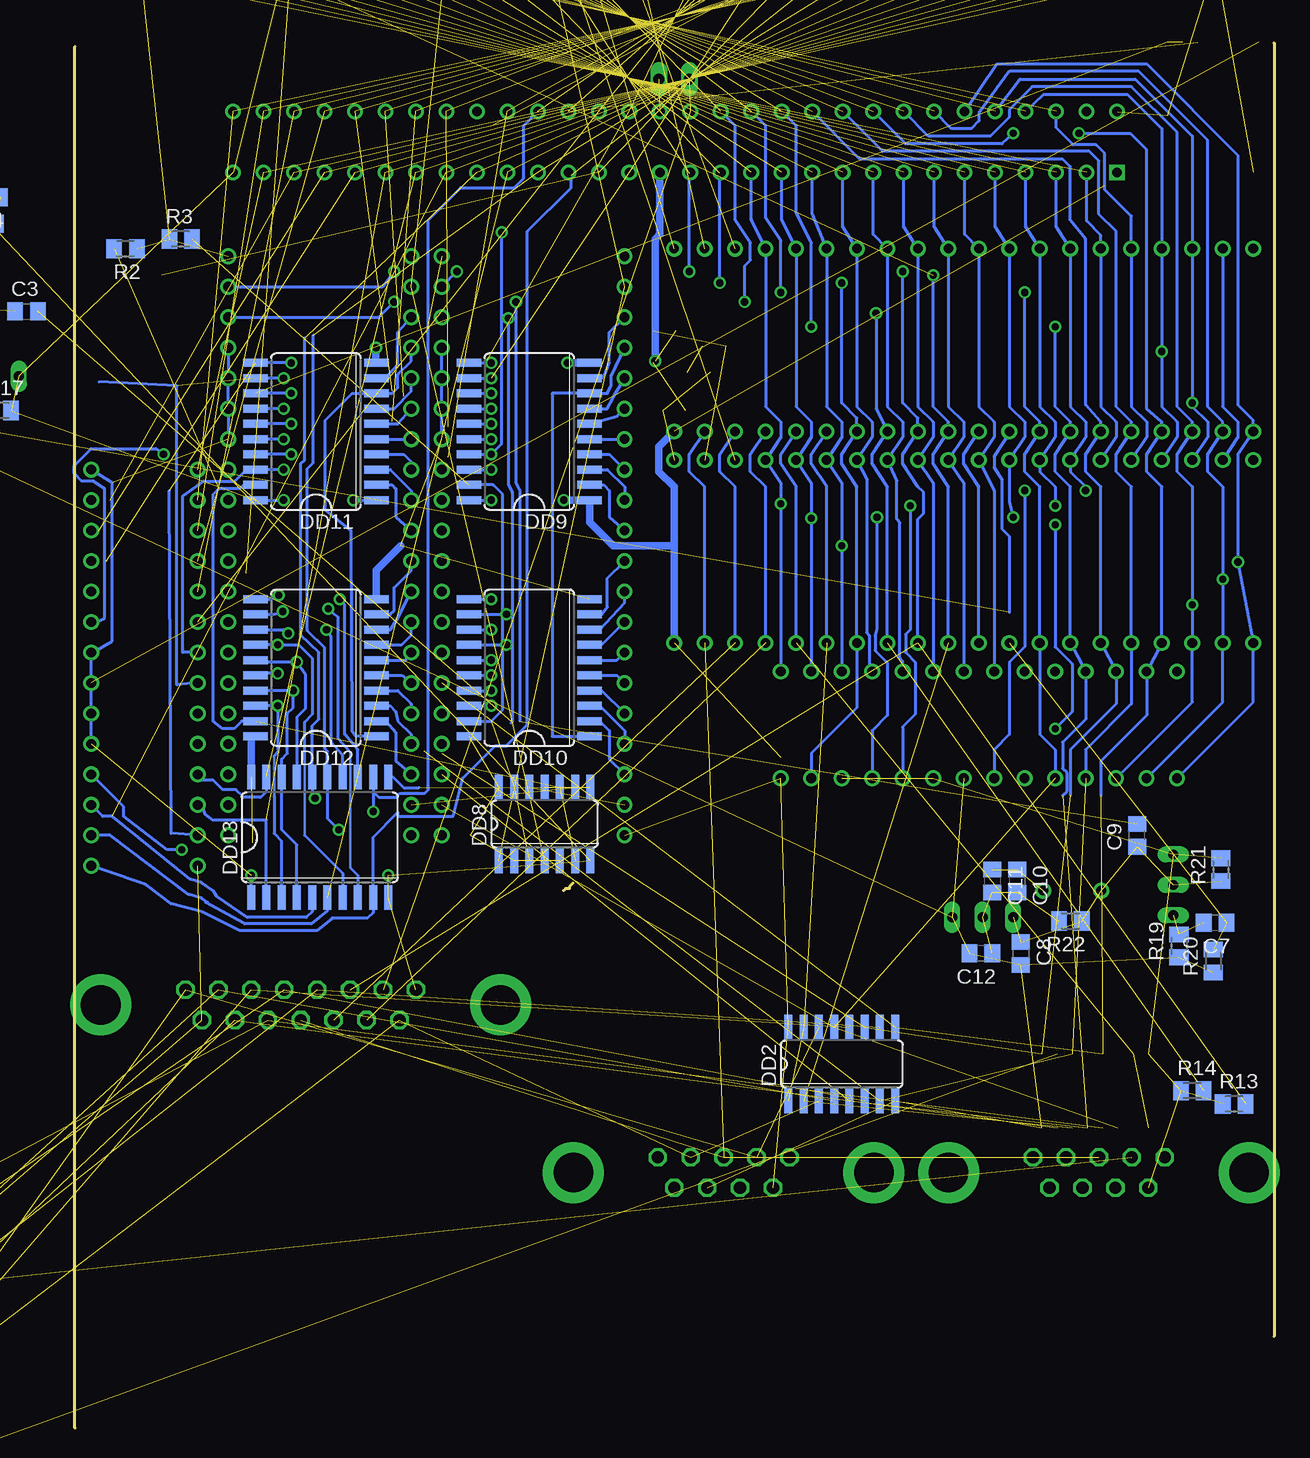
[diagram p4: board, bottom side, seen from below]

Size 99.93 x 115.41 mm. Coordinates in mm from the lower left corner, seen from the top.
Outline: 0,115.41 0,7.62
Outline: 99.93,0 99.93,115.09
Copper layers (1*16): Top 0.035mm / dielectric 1.5mm / Bottom 0.035mm
Design rules "default": minimum track width 0.2mm, minimum drill 24mil, track to track 0.2mm, track to pad 8mil, pad to pad 8mil, via to via 8mil, smd to smd 8mil, copper to edge 40mil, drill to drill 8mil, minimum pad ring 10mil, minimum via ring 8mil, stop-mask expansion 4mil, vias tented up to drill 0mil, thermal gap 10mil
Milling: 4 lines

### Footprints (pad centres in the part's own frame; a part is rotated, then mirrored left to right if it is on the bottom)
C0805 = smd 1.3 x 1.5: 1 -0.95,0; 2 0.95,0
SMC_A = smd 1.6 x 1.4: + -1.5,0; - 1.5,0
SOD80C = smd 1.4 x 1.8: A 1.7,0; C -1.7,0
SO16 = smd 0.66 x 2.032: 1 -4.445,-3.073; 2 -3.175,-3.073; 3 -1.905,-3.073; 4 -0.635,-3.073; 5 0.635,-3.073; 6 1.905,-3.073; 7 3.175,-3.073; 8 4.445,-3.073; 9 4.445,3.073; 10 3.175,3.073; 11 1.905,3.073; 12 0.635,3.073; 13 -0.635,3.073; 14 -1.905,3.073; 15 -3.175,3.073; 16 -4.445,3.073
DIL40 = drill 0.813: 1 -24.13,-7.62; 2 -21.59,-7.62; 3 -19.05,-7.62; 4 -16.51,-7.62; 5 -13.97,-7.62; 6 -11.43,-7.62; 7 -8.89,-7.62; 8 -6.35,-7.62; 9 -3.81,-7.62; 10 -1.27,-7.62; 11 1.27,-7.62; 12 3.81,-7.62; 13 6.35,-7.62; 14 8.89,-7.62; 15 11.43,-7.62; 16 13.97,-7.62; 17 16.51,-7.62; 18 19.05,-7.62; 19 21.59,-7.62; 20 24.13,-7.62; 21 24.13,7.62; 22 21.59,7.62; 23 19.05,7.62; 24 16.51,7.62; 25 13.97,7.62; 26 11.43,7.62; 27 8.89,7.62; 28 6.35,7.62; 29 3.81,7.62; 30 1.27,7.62; 31 -1.27,7.62; 32 -3.81,7.62; 33 -6.35,7.62; 34 -8.89,7.62; 35 -11.43,7.62; 36 -13.97,7.62; 37 -16.51,7.62; 38 -19.05,7.62; 39 -21.59,7.62; 40 -24.13,7.62
SO14 = smd 0.66 x 2.032: 1 -3.81,-3.073; 2 -2.54,-3.073; 3 -1.27,-3.073; 4 0,-3.073; 5 1.27,-3.073; 6 2.54,-3.073; 7 3.81,-3.073; 8 3.81,3.073; 9 2.54,3.073; 10 1.27,3.073; 11 0,3.073; 12 -1.27,3.073; 13 -2.54,3.073; 14 -3.81,3.073
SO20W = smd 0.66 x 2.032: 1 -5.715,-5.029; 2 -4.445,-5.029; 3 -3.175,-5.029; 4 -1.905,-5.029; 5 -0.635,-5.029; 6 0.635,-5.029; 7 1.905,-5.029; 8 3.175,-5.029; 9 4.445,-5.029; 10 5.715,-5.029; 11 5.715,5.029; 12 4.445,5.029; 13 3.175,5.029; 14 1.905,5.029; 15 0.635,5.029; 16 -0.635,5.029; 17 -1.905,5.029; 18 -3.175,5.029; 19 -4.445,5.029; 20 -5.715,5.029
DIL28-6S = drill 0.813: 1 -16.51,-4.445; 2 -13.97,-4.445; 3 -11.43,-4.445; 4 -8.89,-4.445; 5 -6.35,-4.445; 6 -3.81,-4.445; 7 -1.27,-4.445; 8 1.27,-4.445; 9 3.81,-4.445; 10 6.35,-4.445; 11 8.89,-4.445; 12 11.43,-4.445; 13 13.97,-4.445; 14 16.51,-4.445; 15 16.51,4.445; 16 13.97,4.445; 17 11.43,4.445; 18 8.89,4.445; 19 6.35,4.445; 20 3.81,4.445; 21 1.27,4.445; 22 -1.27,4.445; 23 -3.81,4.445; 24 -6.35,4.445; 25 -8.89,4.445; 26 -11.43,4.445; 27 -13.97,4.445; 28 -16.51,4.445
JP1 = drill 0.914 long: 1 0,-1.27; 2 0,1.27
M0805 = smd 1.3 x 1.6: 1 -0.95,0; 2 0.95,0
B3F-10XX = drill 1.016 long: 1 -3.251,2.261; 2 3.251,2.261; 3 -3.251,-2.261; 4 3.251,-2.261
DIP02YL = drill 0.813 long: 1 -1.27,-3.81; 2 1.27,-3.81; 3 1.27,3.81; 4 -1.27,3.81
9077-1 = drill 0.813 long: 1 -2.54,-1.016; 2 0,-1.016; 3 2.54,-1.016
CON_60 = drill 0.8 square: 1 -36.83,-2.54 | drill 0.8: 2 -34.29,-2.54; 3 -31.75,-2.54; 4 -29.21,-2.54; 5 -26.67,-2.54; 6 -24.13,-2.54; 7 -21.59,-2.54; 8 -19.05,-2.54; 9 -16.51,-2.54; 10 -13.97,-2.54; 11 -11.43,-2.54; 12 -8.89,-2.54; 13 -6.35,-2.54; 14 -3.81,-2.54; 15 -1.27,-2.54; 16 1.27,-2.54; 17 3.81,-2.54; 18 6.35,-2.54; 19 8.89,-2.54; 20 11.43,-2.54; 21 13.97,-2.54; 22 16.51,-2.54; 23 19.05,-2.54; 24 21.59,-2.54; 25 24.13,-2.54; 26 26.67,-2.54; 27 29.21,-2.54; 28 31.75,-2.54; 29 34.29,-2.54; 30 36.83,-2.54; 31 -36.83,2.54; 32 -34.29,2.54; 33 -31.75,2.54; 34 -29.21,2.54; 35 -26.67,2.54; 36 -24.13,2.54; 37 -21.59,2.54; 38 -19.05,2.54; 39 -16.51,2.54; 40 -13.97,2.54; 41 -11.43,2.54; 42 -8.89,2.54; 43 -6.35,2.54; 44 -3.81,2.54; 45 -1.27,2.54; 46 1.27,2.54; 47 3.81,2.54; 48 6.35,2.54; 49 8.89,2.54; 50 11.43,2.54; 51 13.97,2.54; 52 16.51,2.54; 53 19.05,2.54; 54 21.59,2.54; 55 24.13,2.54; 56 26.67,2.54; 57 29.21,2.54; 58 31.75,2.54; 59 34.29,2.54; 60 36.83,2.54
CON_72 = drill 0.8 square: 1 44.45,-2.54 | drill 0.8: 2 41.91,-2.54; 3 39.37,-2.54; 4 36.83,-2.54; 5 34.29,-2.54; 6 31.75,-2.54; 7 29.21,-2.54; 8 26.67,-2.54; 9 24.13,-2.54; 10 21.59,-2.54; 11 19.05,-2.54; 12 16.51,-2.54; 13 13.97,-2.54; 14 11.43,-2.54; 15 8.89,-2.54; 16 6.35,-2.54; 17 3.81,-2.54; 18 1.27,-2.54; 19 -1.27,-2.54; 20 -3.81,-2.54; 21 -6.35,-2.54; 22 -8.89,-2.54; 23 -11.43,-2.54; 24 -13.97,-2.54; 25 -16.51,-2.54; 26 -19.05,-2.54; 27 -21.59,-2.54; 28 -24.13,-2.54; 29 -26.67,-2.54; 30 -29.21,-2.54; 31 -31.75,-2.54; 32 -34.29,-2.54; 33 -36.83,-2.54; 34 -39.37,-2.54; 35 -41.91,-2.54; 36 -44.45,-2.54; 37 44.45,2.54; 38 41.91,2.54; 39 39.37,2.54; 40 36.83,2.54; 41 34.29,2.54; 42 31.75,2.54; 43 29.21,2.54; 44 26.67,2.54; 45 24.13,2.54; 46 21.59,2.54; 47 19.05,2.54; 48 16.51,2.54; 49 13.97,2.54; 50 11.43,2.54; 51 8.89,2.54; 52 6.35,2.54; 53 3.81,2.54; 54 1.27,2.54; 55 -1.27,2.54; 56 -3.81,2.54; 57 -6.35,2.54; 58 -8.89,2.54; 59 -11.43,2.54; 60 -13.97,2.54; 61 -16.51,2.54; 62 -19.05,2.54; 63 -21.59,2.54; 64 -24.13,2.54; 65 -26.67,2.54; 66 -29.21,2.54; 67 -31.75,2.54; 68 -34.29,2.54; 69 -36.83,2.54; 70 -39.37,2.54; 71 -41.91,2.54; 72 -44.45,2.54
TO92-CBE = drill 0.813 long: B 0,0; C -2.54,0; E 2.54,0
M09HP = drill 1.016 octagon: 1 -5.486,1.27; 2 -2.743,1.27; 3 0,1.27; 4 2.743,1.27; 5 5.486,1.27; 6 -4.115,-1.27; 7 -1.372,-1.27; 8 1.372,-1.27; 9 4.115,-1.27 | drill 3.302 pad 5.08: G1 -12.522,0; G2 12.522,0
M15HP = drill 1.016 octagon: 1 -9.601,1.27; 2 -6.858,1.27; 3 -4.115,1.27; 4 -1.372,1.27; 5 1.372,1.27; 6 4.115,1.27; 7 6.858,1.27; 8 9.601,1.27; 9 -8.23,-1.27; 10 -5.486,-1.27; 11 -2.743,-1.27; 12 0,-1.27; 13 2.743,-1.27; 14 5.486,-1.27; 15 8.23,-1.27 | drill 3.302 pad 5.08: G1 -16.662,0; G2 16.662,0
HC49/S = drill 0.813: 1 -2.413,0; 2 2.413,0

### Placement (x,y rotation side)
C1  109.7,84.45 90 bottom  (outside the outline)
C2  112.24,91.44 180 bottom  (outside the outline)
C3  103.98,93.03 0 bottom  (outside the outline)
C4  107.16,102.55 180 bottom  (outside the outline)
C5  107.47,100.33 180 bottom  (outside the outline)
C6  110.33,102.87 90 bottom  (outside the outline)
C7  4.92,42.07 180 bottom
C8  21.11,39.53 270 bottom
C9  11.43,49.37 90 bottom
C10  21.43,45.56 270 bottom
C11  23.5,45.56 270 bottom
C12  24.45,39.53 180 bottom
C13  76.99,182.88 0 top  (outside the outline)
D1  76.99,178.12 180 top  (outside the outline)
DD1  14.92,28.1 0 top
DD2  36.04,30.32 0 bottom
DD3  13.18,90.65 0 top
DD4  25.88,90.65 180 top
DD5  25.88,73.03 180 top
DD6  61.75,73.5 90 top
DD7  79.53,73.5 90 top
DD8  60.8,50.32 0 bottom
DD9  62.07,83.03 90 bottom
DD10  62.07,63.34 90 bottom
DD11  79.85,83.03 90 bottom
DD12  79.85,63.34 90 bottom
DD13  79.53,49.21 0 bottom
DD14  24.61,58.58 180 top
DD15  94.14,63.34 90 top
DD16  5.08,112.39 180 top
DD18  68.9,162.72 0 top  (outside the outline)
JP1  50.01,112.39 270 top
R1  120.81,0.79 0 bottom  (outside the outline)
R2  95.73,98.27 180 bottom
R3  91.12,99.06 0 bottom
R4  116.68,11.27 0 bottom  (outside the outline)
R5  122.4,13.18 0 bottom  (outside the outline)
R6  111.92,-2.54 0 bottom  (outside the outline)
R7  119.06,-1.91 0 bottom  (outside the outline)
R8  122.08,8.89 0 bottom  (outside the outline)
R9  122.08,4.76 0 bottom  (outside the outline)
R10  117,7.94 0 bottom  (outside the outline)
R11  114.46,4.45 0 bottom  (outside the outline)
R12  117,0.95 0 bottom  (outside the outline)
R13  3.33,26.99 0 bottom
R14  6.83,28.1 0 bottom
R15  112.24,86.68 0 bottom  (outside the outline)
R16  112.55,83.19 0 bottom  (outside the outline)
R17  106.2,84.77 0 bottom  (outside the outline)
R18  110.01,94.62 90 bottom  (outside the outline)
R19  7.94,40.16 90 bottom
R20  5.08,38.89 90 bottom
R21  4.45,46.51 90 bottom
R22  16.99,42.23 180 bottom
R23  76.36,179.7 0 top  (outside the outline)
R24  101.76,167.64 0 top  (outside the outline)
R25  101.76,161.61 0 top  (outside the outline)
R26  73.18,173.67 0 top  (outside the outline)
R27  64.29,176.53 0 top  (outside the outline)
R28  66.36,183.51 0 top  (outside the outline)
R29  68.58,176.21 0 top  (outside the outline)
R30  47.94,87.95 0 top
R31  50.8,91.44 0 top
R32  50.01,84.77 0 top
R33  46.67,90.17 0 top
R34  62.23,170.02 0 top  (outside the outline)
R35  78.58,175.42 90 top  (outside the outline)
R36  84.46,160.5 0 top  (outside the outline)
R37  91.44,161.61 180 top  (outside the outline)
S1  76.36,187.8 0 top  (outside the outline)
S2  105.57,176.53 0 top  (outside the outline)
S3  96.52,179.7 0 top  (outside the outline)
SLOT_F  49.93,107.16 0 top
SLOT_N  49.93,122.87 0 top  (outside the outline)
VT1  107.16,87.63 0 top  (outside the outline)
VT2  112.55,101.6 90 top  (outside the outline)
VT3  8.41,45.24 270 top
VT4  24.29,42.55 0 top
X1  14.61,21.27 0 top
X2  45.88,21.27 0 top
X3  81.12,35.24 0 top
Z1  107.16,95.57 90 top  (outside the outline)
Z2  16.83,44.77 0 top

### Tracks (layer width: path | path; a pad name or v marks a point on that pad's centre or on a via)
4016CUP  (2 unrouted)
  Top 0.254: DD1.7 18.1,23.29 X1.4
4016RD_!OE  (2 unrouted)
  Bottom 0.254: DD5.36 39.85,78.42 41.12,80.33 41.12,81.12 DD4.36
4016RD_D0  (1 unrouted)
  Top 0.254: DD1.2 11.75,22.66 X1.2
4016RD_D1  (2 unrouted)
4016WR_B0  (3 unrouted)
  Bottom 0.254: DD5.39 47.47,78.42 48.74,79.69 48.74,81.12 DD4.39
4016WR_B1  (1 unrouted)
  Bottom 0.254: DD5.38 44.93,78.42 46.2,79.69 46.2,81.12 DD4.38
4016WR_B2  (1 unrouted)
  Bottom 0.254: DD5.37 42.39,78.42 43.66,79.69 43.66,81.12 DD4.37
4017CUP  (3 unrouted)
4017RD_!OE  (2 unrouted)
  Bottom 0.254: DD5.35 37.31,78.42 38.58,80.33 38.58,81.12 DD4.35
4017RD_D0  (3 unrouted)
4017RD_D1  (2 unrouted)
4017RD_D2  (2 unrouted)
4017RD_D3  (2 unrouted)
4017RD_D4  (2 unrouted)
!IRQ  (via drill 0.6)  (3 unrouted)
  Top 0.254: v30.96,96.36 v48.74,96.36
  Bottom 0.254: v30.96,96.36 30.96,85.41 29.69,84.14 DD4.32 30.96,81.12 30.96,80.33 29.69,78.42 29.21,77.95 29.21,76.2 29.69,75.72 DD5.32 | v48.74,96.36 48.74,104.54 SLOT_F.15
!NMI  (via drill 0.6)  (1 unrouted)
  Top 0.254: v73.34,96.36 v68.1,96.36 | v33.18,92.87 45.24,92.87 46.35,93.98 56.04,93.98 57.15,95.09 DD6.19
  Bottom 0.254: DD5.33 32.23,78.42 33.5,80.33 33.5,81.12 DD4.33 33.18,84.93 v33.18,92.87 | DD7.19 74.29,95.09 v73.34,96.36 | v68.1,96.36 DD6.19
!PA13  (2 unrouted)
!PPU
  Top 0.254: DD7.13 86.12,78.82 70.56,78.82 69.53,79.85 DD6.13 68.42,78.9 55.56,78.9 55.24,78.58 52.39,78.58 51.75,79.22 13.65,79.22 13.18,79.69 13.18,83.5 13.81,84.14 DD3.5
!PRD  (via drill 0.6)  (3 unrouted)
  Top 0.254: v65.25,87.47 67.63,87.47 68.66,88.5 72.63,88.5 73.66,87.47 v82.55,87.47
  Bottom 0.254: DD9.12 v65.25,87.47 | v82.55,87.47 DD11.12 | DD15.22 91.44,61.91 91.44,86.84 97.95,87.15
!PWE  (via drill 0.6)  (3 unrouted)
  Top 0.254: v65.25,88.74 65.4,88.74 65.56,88.98 81.52,88.98 v81.91,88.74
  Bottom 0.254: DD9.11 v65.25,88.74 | v81.91,88.74 DD11.11 | DD15.27 91.92,49.53 92.07,78.11
!RAM  (via drill 0.6)
  Top 0.254: DD3.4 12.54,85.72 10.64,83.82 10.64,77.79 13.18,75.25 v18.26,75.25 | v18.26,58.26 20.8,55.72 DD14.20
  Bottom 0.254: v18.26,75.25 18.26,65.09 16.83,63.66 16.83,59.69 v18.26,58.26
!ROMSEL  (via drill 0.6)  (1 unrouted)
  Top 0.254: DD3.9 44.03,93.72 v44.13,93.82
  Bottom 0.254: v44.13,93.82 44.13,96.84 43.66,97.31 43.66,98.74 44.93,100.65 44.93,108.51 SLOT_F.44
!RST21  (2 unrouted)
!RST26  (2 unrouted)
!RST_P21  (4 unrouted)
!RST_P26  (4 unrouted)
+5V  (via drill 0.6)  (38 unrouted)
  Top 0.254: DD14.26 36.04,55.88 41.12,55.88 DD14.28 | DD6.40 66.99,49.37 68.42,47.94 70.48,47.94 DD7.40 75.96,49.37 76.6,48.74 85.17,48.74 87.79,46.83 DD15.28 | SLOT_F.31 13.02,109.62 13.02,107.08 14.13,105.97 14.13,103.5 10.48,99.85 10.48,96.68 8.73,95.41 DD3.16 | v82.55,77.31 v76.76,77.31 73.74,77.31 72.71,78.34 68.18,78.34 67.15,77.31 v65.25,77.31
  Top 0.61: v59.21,77.31 v65.25,77.31
  Bottom 0.254: DD11.20 v82.55,77.31 | DD9.20 v65.25,77.31 | v76.76,77.31 DD11.1
  Bottom 0.61: DD5.40 50.01,73.5 | 50.01,73.5 50.01,78.42 51.28,79.69 51.28,81.76 DD4.40 | DD13.20 85.25,57.63 DD12.20 | v59.21,77.31 DD9.1 57.04,75.46 55.09,73.5 50.01,73.5
A0  (via drill 0.6)  (1 unrouted)
  Top 0.254: DD7.12 86.12,76.28 70.41,76.28 DD6.12 68.1,76.04 55.56,76.04 55.32,76.28 53.42,76.28 52.7,76.99 v41.12,76.99
  Bottom 0.254: SLOT_F.13 43.58,100.73 DD4.4 42.39,85.09 41.12,83.82 41.12,82.55 DD5.4 41.12,78.74 v41.12,76.99 DD14.1
A1  (via drill 0.6)  (1 unrouted)
  Top 0.254: v38.58,75.8 54.85,75.8 55.88,74.77 DD6.11 70.41,75.8 73.26,75.8 74.29,74.77 DD7.11
  Bottom 0.254: SLOT_F.12 41.04,100.73 DD4.5 39.85,85.09 38.58,83.82 38.58,82.55 DD5.5 38.58,78.74 v38.58,75.8 DD14.2
A2  (via drill 0.6)  (1 unrouted)
  Top 0.254: DD7.10 85.88,73.5 70.64,73.5 DD6.10 56.2,72.23 54.93,73.5 v36.04,73.5
  Bottom 0.254: SLOT_F.11 38.5,101.2 DD4.6 37.31,85.09 36.04,83.82 36.04,82.55 DD5.6 36.04,78.74 v36.04,73.5 DD14.3
A3  (1 unrouted)
  Bottom 0.254: SLOT_F.10 35.96,100.09 DD4.7 34.77,85.09 33.5,83.82 33.5,82.55 DD5.7 33.97,79.06 33.97,66.28 33.73,66.04 33.73,63.26 DD14.4
A4  (1 unrouted)
  Bottom 0.254: SLOT_F.9 33.42,99.46 DD4.8 32.23,85.09 30.96,83.82 30.96,82.55 DD5.8 31.43,78.9 31.43,75.72 31.19,75.41 31.19,64.14 30.96,63.9 DD14.5
A5  (1 unrouted)
  Bottom 0.254: SLOT_F.8 30.88,100.09 DD4.9 29.69,85.09 28.42,83.82 28.42,82.55 DD5.9 28.42,78.74 DD14.6
A6  (1 unrouted)
  Bottom 0.254: SLOT_F.7 28.34,100.09 DD4.10 27.15,85.09 25.88,83.82 25.88,82.55 DD5.10 25.88,78.74 DD14.7
A7  (1 unrouted)
  Bottom 0.254: SLOT_F.6 25.8,99.46 DD4.11 24.61,85.09 23.34,83.82 23.34,82.55 DD5.11 23.34,78.11 DD14.8
A8  (via drill 0.6)  (1 unrouted)
  Top 0.254: v21.75,75.88 v33.1,75.88
  Bottom 0.254: SLOT_F.5 23.26,100.09 DD4.12 22.07,85.09 20.8,83.82 20.8,82.55 DD5.12 22.07,77.15 v21.75,75.88 | v33.1,75.88 33.1,66.6 33.26,66.04 33.26,64.77 32.23,63.74 32.23,59.37 33.5,58.1 DD14.25
A9  (via drill 0.6)  (1 unrouted)
  Top 0.254: v18.26,76.83 v30.32,76.83
  Bottom 0.254: SLOT_F.4 20.72,100.09 DD4.13 19.53,85.09 18.26,83.82 18.26,82.55 DD5.13 19.53,79.69 18.26,78.42 v18.26,76.83 | v30.32,76.83 30.32,66.52 30.72,66.12 30.72,64.61 29.92,63.82 29.92,59.45 30.96,58.42 DD14.24
A10  (via drill 0.6)  (1 unrouted)
  Top 0.254: v15.72,78.11 v20.8,78.11
  Bottom 0.254: SLOT_F.3 18.18,100.09 DD4.14 16.99,85.09 15.72,83.82 15.72,82.55 DD5.14 16.99,79.69 15.72,78.42 v15.72,78.11 | v20.8,78.11 20.8,65.09 22.07,63.82 22.07,57.78 23.34,56.52 DD14.21
A11  (1 unrouted)
  Bottom 0.254: DD5.15 13.18,82.55 13.18,83.82 14.45,85.09 DD4.15 14.45,99.38 15.64,100.57 SLOT_F.2
A12  (1 unrouted)
  Bottom 0.254: DD5.16 10.64,82.55 10.64,83.82 11.91,85.09 DD4.16 11.91,100.97 14.13,103.19 14.13,106.2 14.84,106.92 16.75,106.92 18.18,108.35 SLOT_F.33
A13  (via drill 0.6)  (1 unrouted)
  Top 0.254: DD3.2 10,89.22 9.68,89.69 v9.37,89.69
  Bottom 0.254: DD5.17 8.1,82.55 8.1,83.82 9.37,85.09 v9.37,89.69 DD4.17 9.37,108.27 12.22,111.12 19.21,111.12 SLOT_F.34
A14  (via drill 0.6)  (1 unrouted)
  Top 0.254: DD3.3 11.27,86.04 10.64,85.41 v6.83,85.41
  Bottom 0.254: DD5.18 5.56,82.55 5.56,83.82 6.83,85.09 v6.83,85.41 DD4.18 6.83,107.63 11.59,112.39 21.19,112.39 SLOT_F.35
A15
  Top 0.254: DD3.13 12.54,92.08 11.91,91.44 7.46,91.44 5.56,89.53 5.56,81.91 DD5.19
  Bottom 0.254: DD4.19 4.29,85.09 3.02,83.82 3.02,82.55 DD5.19
CIRAM-A10  (2 unrouted)
  Top 0.254: DD15.10 99.85,69.69 102.08,71.91 102.08,90.49 92.71,96.04
CIRAM-CS  (2 unrouted)
CLK21  (2 unrouted)
  Bottom 0.254: DD4.29 22.07,82.87 23.34,80.96 23.34,80.01 22.7,79.06 22.7,74.93 22.07,74.3 22.07,67.94
CLK26  (2 unrouted)
CLK_P21  (via drill 0.6)  (1 unrouted)
  Top 0.254: DD6.18 66.91,92.55 v63.82,92.47
  Bottom 0.254: v63.82,92.47 63.82,78.58 63.5,77.95 63.5,58.82 63.58,58.74
CLK_P26  (via drill 0.6)  (1 unrouted)
  Top 0.254: v73.34,93.82 v63.18,93.82
  Bottom 0.254: DD7.18 74.61,92.55 v73.34,93.82 | v63.18,93.82 63.18,78.74 62.86,78.11 62.86,58.9
D0  (via drill 0.6)  (4 unrouted)
  Top 0.254: DD6.2 70.41,52.94 75.17,52.94 76.2,51.91 79.14,51.91 79.45,51.59 80.49,51.59 80.8,51.91 DD7.2 | v20.8,94.62 v41.12,94.62
  Bottom 0.254: v20.8,94.62 20.8,85.09 19.53,83.82 DD4.28 20.8,81.12 20.8,79.69 19.53,78.42 DD5.28 19.53,57.78 18.26,56.52 DD14.19 | v41.12,94.62 41.12,98.9 42.39,100.81 42.39,108.51 SLOT_F.43
D1  (via drill 0.6)  (4 unrouted)
  Top 0.254: DD6.3 70.41,53.42 85.49,53.42 DD7.3 | v18.26,91.76 v38.58,91.76
  Bottom 0.254: 17.62,52.7 17.3,53.02 17.3,54.61 17.62,54.93 17.62,57.15 15.72,59.05 DD14.11 DD5.27 16.99,78.42 18.26,79.69 18.26,81.12 DD4.27 16.99,83.82 18.26,85.09 v18.26,91.76 | v38.58,91.76 38.58,98.74 39.85,101.28 39.85,108.51 SLOT_F.42
D2  (4 unrouted)
  Top 0.254: DD7.4 86.12,55.48 70.09,55.48 69.37,56.2 DD6.4
  Bottom 0.254: SLOT_F.41 34.53,105.73 17.62,105.73 16.99,105.09 16.99,100.65 15.72,99.06 15.72,85.25 14.45,83.82 DD4.26 15.72,81.12 15.72,79.69 14.45,78.42 DD5.26 DD14.12 13.18,60.32 16.99,56.52 16.99,52.7
D3  (4 unrouted)
  Top 0.254: DD7.5 84.45,59.53 83.34,55.96 71.36,55.96 70.88,56.44 70.88,57.47 69.37,58.98 DD6.5
  Bottom 0.254: SLOT_F.40 32.62,106.36 15.4,106.36 14.6,105.57 14.6,101.12 13.18,99.69 13.18,85.09 11.91,83.82 DD4.25 13.18,81.12 13.18,79.69 11.91,78.42 DD5.25 11.91,60.32 15.72,56.52 DD14.18
D4  (via drill 0.6)  (4 unrouted)
  Top 0.254: v16.27,107.87 v21.75,107.87 | DD6.6 70.09,61.75 71.28,60.56 73.34,60.56 74.85,62.07 80.88,62.07 81.12,62.31 82.23,62.31 82.63,61.91 83.74,61.91 83.9,62.07 DD7.6
  Bottom 0.254: v21.75,107.87 22.7,107 30.72,107 SLOT_F.39 | 14.45,52.7 14.45,55.56 10.64,59.37 DD14.13 DD5.24 9.37,78.42 10.64,79.69 10.64,81.12 DD4.24 9.37,83.82 10.64,84.93 10.64,106.52 11.99,107.87 v16.27,107.87
D5  (via drill 0.6)  (1 unrouted)
  Top 0.254: DD7.7 83.82,64.61 83.58,64.37 82.23,64.37 81.91,64.69 73.66,64.69 72.55,63.58 71.36,63.58 70.33,64.61 DD6.7 69.06,64.93 64.93,64.93 64.29,64.29 59.05,64.29 54.77,68.58 v6.83,68.58
  Bottom 0.254: SLOT_F.38 28.81,107.63 23.65,107.63 22.07,109.22 22.07,109.85 20.16,111.76 11.91,111.76 8.1,107.95 8.1,85.09 6.83,83.82 DD4.23 8.1,81.12 8.1,79.69 6.83,78.42 v6.83,68.58 DD5.23 6.83,60.48 DD14.17
D6  (via drill 0.6)  (1 unrouted)
  Top 0.254: DD7.8 79.69,67.15 79.45,67.39 78.1,67.39 77.87,67.15 73.74,67.15 72.71,68.18 71.36,68.18 70.33,67.15 DD6.8 69.06,67.47 65.09,67.47 64.29,66.83 58.9,66.83 55.01,70.72 v4.29,70.72
  Bottom 0.254: SLOT_F.37 26.91,108.27 25.24,108.27 24.61,108.9 24.61,109.54 22.07,113.03 11.27,113.03 5.56,107.31 5.56,85.09 4.29,83.82 DD4.22 5.56,81.12 5.56,79.69 4.29,78.42 v4.29,70.72 DD5.22 4.29,60.48 DD14.16
D7  (via drill 0.6)  (1 unrouted)
  Top 0.254: DD7.9 85.65,71.2 70.88,71.2 DD6.9 68.98,70.09 56.75,70.09 55.64,71.2 53.5,71.2 52.55,72.15 v3.02,72.15
  Bottom 0.254: SLOT_F.36 23.1,113.66 10.64,113.66 3.02,106.05 3.02,85.25 1.75,83.98 DD4.21 3.02,81.12 v3.02,72.15 DD5.21 1.75,60.48 DD14.15
GND  (via drill 0.6)  (40 unrouted)
  Top 0.254: DD5.20 1.75,69.29 7.94,66.52 DD14.14 8.1,62.87 9.37,61.59 16.83,61.59 DD14.10 DD14.9 | DD14.9 20.8,66.99 24.61,66.99 DD5.30 | DD14.9 20.8,57.15 25.88,57.15 DD14.22 | v85.25,46.04 v73.82,46.04 | DD3.15 10,92.55 9.52,92.08 1.75,92.08 | DD3.8 17.62,85.88 18.89,84.61 23.81,84.61 24.61,83.82 DD4.30 | DD1.8 19.37,23.81 18.73,23.18 18.73,21.75 18.26,21.27 17.25,21.27 X1.8
  Top 0.61: 1.75,85.41 3.02,84.14 3.02,81.91 DD5.20 | DD7.17 v74.85,90.01 73.18,91.28 70.64,91.28 DD6.17 60.17,90.01 v58.9,88.74 51.75,88.74 v51.59,88.9 | DD6.20 70.8,99.38 86.36,99.38 DD7.20
  Top 1.27: SLOT_F.1 1.75,104.62 DD4.20 1.75,92.08 1.75,85.41
  Bottom 0.254: DD5.30 24.61,78.42 25.88,80.33 25.88,81.12 DD4.30 | DD6.14 DD6.15 DD6.16 DD6.17 | DD7.17 DD7.16 DD7.15 DD7.14 | DD13.1 v85.25,46.04 | DD15.5 DD15.6 DD15.7 DD15.8 98.42,64.61 96.84,65.56 96.84,78.74 DD15.14
  Bottom 0.61: DD9.10 v58.9,88.74 | v74.85,90.01 74.85,88.77 DD11.10 | DD12.10 74.82,71.47 72.79,73.5 | SLOT_F.16 51.2,99.46 51.59,99.06 v51.59,88.9
M2  (via drill 0.6)  (3 unrouted)
  Top 0.254: DD3.14 11.27,95.41 12.54,96.04 13.02,96.04 | 13.02,96.04 v28.42,96.04 | 13.02,96.04 13.02,101.28 14.6,102.87 14.6,108.66 SLOT_F.32
  Bottom 0.254: DD5.31 27.15,78.42 28.42,80.33 28.42,81.12 DD4.31 27.15,83.82 28.42,85.09 v28.42,96.04
N$1
  Bottom 0.254: DD9.9 56.04,87.47 55.72,87.95 55.4,88.74 55.4,91.28 DD6.23
N$2
  Bottom 0.254: DD6.24 55.24,87.63 55.24,86.84 55.56,86.2 DD9.8 60.17,86.2 60.17,57.63 DD10.1
N$3
  Bottom 0.254: DD9.7 55.56,84.93 54.77,86.36 DD6.25
N$4
  Bottom 0.254: DD9.6 54.77,84.3 DD6.26
N$5
  Bottom 0.254: DD9.5 DD6.27
N$6
  Bottom 0.254: DD9.4 55.4,81.12 DD6.28
N$7
  Bottom 0.254: DD9.3 55.56,79.85 54.13,78.42 DD6.29
N$8
  Bottom 0.254: DD9.2 55.88,78.58 55.4,78.11 55.4,75.88 DD6.30
N$9
  Bottom 0.254: DD10.9 56.04,67.79 55.56,68.42 55.56,70.8 DD6.31
N$10
  Bottom 0.254: DD10.8 56.2,66.52 54.13,68.74 DD6.32
N$11
  Bottom 0.254: DD10.7 56.04,65.25 DD6.33
N$12
  Bottom 0.254: DD10.6 54.77,63.98 DD6.34
N$13
  Bottom 0.254: DD10.5 54.77,62.71 DD6.35
N$14
  Bottom 0.254: DD10.4 56.04,61.44 DD6.36
N$15
  Bottom 0.254: DD10.3 56.2,60.17 54.13,58.1 DD6.37
N$16
  Bottom 0.254: DD10.2 56.2,58.9 55.4,58.1 55.4,55.72 DD6.38
N$17  (3 unrouted)
  Bottom 0.254: DD10.19 65.25,58.9 64.29,59.85 64.29,77.79 65.09,78.58 DD9.19
N$18  (1 unrouted)
N$19  (2 unrouted)
N$20
  Bottom 0.254: DD11.9 74.14,87.47 73.02,88.58 73.02,91.28 DD7.23
N$21
  Bottom 0.254: DD7.24 71.91,88.9 73.02,87.79 73.02,86.68 73.5,86.2 DD11.8 76.83,86.2 79.06,83.98 79.06,76.52 76.91,74.77 76.83,58.02 76.52,57.63 DD12.1
N$22
  Bottom 0.254: DD11.7 73.34,84.93 71.91,86.36 DD7.25
N$23
  Bottom 0.254: DD11.6 73.02,83.66 DD7.26
N$24
  Bottom 0.254: DD11.5 DD7.27
N$25
  Bottom 0.254: DD11.4 72.55,81.12 71.91,80.49 DD7.28
N$26
  Bottom 0.254: DD11.3 73.66,79.85 71.91,78.11 DD7.29
N$27
  Bottom 0.254: DD11.2 73.5,78.58 73.18,78.26 73.18,75.88 DD7.30
N$28
  Bottom 0.254: DD12.9 73.66,67.79 73.34,68.1 73.34,70.01 71.91,71.44 DD7.31
N$29
  Bottom 0.254: DD12.8 73.66,66.52 73.02,67.47 DD7.32
N$30
  Bottom 0.254: DD12.7 72.71,65.25 71.91,66.04 DD7.33
N$31
  Bottom 0.254: DD12.6 72.39,63.98 DD7.34
N$32
  Bottom 0.254: DD12.5 72.71,62.71 DD7.35
N$33
  Bottom 0.254: DD12.4 73.02,61.44 71.91,60.32 DD7.36
N$34
  Bottom 0.254: DD12.3 73.66,60.17 73.18,59.69 73.02,58.9 71.91,57.78 DD7.37
N$35
  Bottom 0.254: DD12.2 73.98,58.9 73.18,57.94 73.18,55.56 DD7.38
N$36  (3 unrouted)
  Bottom 0.254: DD12.19 86.04,58.9 86.68,58.26 87.63,58.26 88.42,58.9 88.42,77.79 87.95,78.26 86.2,78.26 85.88,78.58 DD11.19
N$37
  Top 0.254: DD3.1 8.73,88.74 8.25,89.22 8.25,90.17 8.73,90.65 13.49,90.65 15.08,92.23 DD3.11
N$38  (1 unrouted)
N$39  (2 unrouted)
N$40  (1 unrouted)
N$41  (6 unrouted)
N$42  (4 unrouted)
N$43  (6 unrouted)
N$44  (2 unrouted)
N$45  (2 unrouted)
N$46  (4 unrouted)
N$48  (6 unrouted)
N$50  (2 unrouted)
N$53  (1 unrouted)
PA0  (2 unrouted)
  Bottom 0.254: DD13.2 83.98,50.64 88.42,50.64 89.06,51.12 89.38,51.91 DD15.26
PA1  (2 unrouted)
  Bottom 0.254: DD13.19 83.98,53.02 84.45,52.55 85.88,52.55 86.52,53.18 87.63,53.18 88.42,53.98 89.69,53.98 DD15.25
PA2  (2 unrouted)
  Bottom 0.254: DD13.5 80.17,43.02 80.64,42.55 85.57,42.55 88.11,44.29 88.42,44.77 89.38,45.4 90.33,45.72 96.84,50.96 97.63,50.96 DD15.3
PA3  (via drill 0.6)  (2 unrouted)
  Top 0.254: v79.93,52.47 85.72,52.47 86.84,53.18 90.49,53.18 90.96,53.66 90.96,55.72 DD15.24
  Bottom 0.254: v79.93,52.47 80.17,52.7 DD13.16 80.17,58.5 79.61,59.05 79.61,64.61 81.12,66.04 81.12,80.33 80.8,80.64 80.8,90.81
PA4  (2 unrouted)
  Bottom 0.254: DD13.6 78.9,43.1 80.25,41.99 85.8,41.99 89.06,43.81 88.9,43.81 89.38,44.13 90.49,44.45 97,49.37 DD15.2
PA5  (via drill 0.6)  (2 unrouted)
  Top 0.254: v77.95,49.85 85.25,49.85 86.99,48.18 v91.04,48.18
  Bottom 0.254: v91.04,48.18 92.23,48.18 95.88,50.96 95.88,51.75 DD15.4 | v77.95,49.85 78.9,50.8 DD13.15 78.9,56.36 79.14,56.59 79.14,65.01 80.57,66.44 80.57,79.93 80.09,80.41 80.09,91.04
PA6  (1 unrouted)
  Bottom 0.254: DD15.1 93.98,45.24 91.92,43.66 89.38,43.02 86.2,41.43 79.77,41.43 78.5,42.47 75.56,42.47 75.09,42.94 DD13.9 75.09,49.21 73.02,51.28 73.02,50.96 68.42,50.96 67.63,54.13 64.93,56.83 63.98,56.83 62.23,58.58 62.23,99.69 58.58,103.35 58.58,104.38 SLOT_F.19
PA7  (via drill 0.6)  (1 unrouted)
  Top 0.254: DD15.23 91.6,57.63 91.6,52.07 90.17,50.64 87.31,50.64 86.04,51.04 79.14,51.04 78.82,51.36 v75.09,51.36
  Bottom 0.254: v75.09,51.36 DD13.12 75.09,53.02 74.61,52.55 73.18,52.55 72.87,52.86 70.8,52.86 70.48,53.18 70.48,100.65 67.79,103.35 63.34,103.35 62.55,104.14 62.55,108.51 SLOT_F.50
PA8  (via drill 0.6)  (2 unrouted)
  Top 0.254: v65.25,79.85 67.79,79.85 68.82,80.88 72.63,80.88 73.66,79.85 v82.55,79.85
  Bottom 0.254: DD9.18 v65.25,79.85 | v82.55,79.85 DD11.18 85.67,79.85 86.63,78.9 89.22,78.9 90.96,77.63 90.96,64.61 DD15.21
PA9  (via drill 0.6)  (1 unrouted)
  Top 0.254: v92.55,81.12 v81.91,81.12 73.66,81.12 73.42,81.36 65.48,81.36 v65.25,81.12 | v64.37,99.62 65.25,100.49 65.25,108.51 SLOT_F.52
  Bottom 0.254: DD9.17 v65.25,81.12 64.37,81.99 v64.37,99.62 | v81.91,81.12 DD11.17 | DD15.9 98.11,67.15 97.47,67.47 97.47,78.26 98.42,78.9 99.38,78.9 100.01,79.53 100.01,80.17 98.58,81.6 93.19,81.6 v92.55,81.12
PA10  (via drill 0.6)  (2 unrouted)
  Top 0.254: v65.25,82.39 67.79,82.39 68.82,83.42 72.63,83.42 73.66,82.39 v82.55,82.39
  Bottom 0.254: DD9.16 v65.25,82.39 | v82.55,82.39 DD11.16
PA11  (via drill 0.6)  (2 unrouted)
  Top 0.254: v65.25,83.66 65.33,83.66 65.56,83.9 73.5,83.9 73.74,83.66 v81.91,83.66
  Bottom 0.254: DD9.15 v65.25,83.66 | v81.91,83.66 DD11.15
PA12  (via drill 0.6)  (2 unrouted)
  Top 0.254: v65.25,84.93 67.63,84.93 68.66,85.96 72.55,85.96 73.58,84.93 v82.55,84.93
  Bottom 0.254: DD9.14 v65.25,84.93 | v82.55,84.93 DD11.14
PA13  (via drill 0.6)  (4 unrouted)
  Top 0.254: v65.25,86.2 65.33,86.2 65.8,86.44 73.5,86.44 73.74,86.2 v81.91,86.2
  Bottom 0.254: DD9.13 v65.25,86.2 | v81.91,86.2 DD11.13
PALE  (2 unrouted)
  Bottom 0.254: DD13.11 73.45,54.24 72.55,53.34 71.28,53.34
PD0  (via drill 0.6)  (2 unrouted)
  Top 0.254: v65.25,60.17 68.18,60.17 68.58,60.56 69.77,60.56 70.41,59.93 70.41,58.66 71.04,58.02 73.1,58.02 75.25,60.17 v83.03,60.17 85.88,60.17 86.28,60.56 97.31,60.56 97.31,72.23 DD15.11
  Bottom 0.2: 83.34,52.63 83.34,55.96
  Bottom 0.254: DD10.18 v65.25,60.17 | DD12.18 v83.03,60.17 83.03,56.28 83.34,55.96 | DD13.3 82.71,48.89 83.34,49.53 83.34,52.63
PD1  (via drill 0.6)  (2 unrouted)
  Top 0.254: v65.25,61.44 68.18,61.44 68.58,61.04 70.01,61.04 70.88,60.17 70.88,58.9 71.28,58.5 72.63,58.5 75.56,61.44 v81.76,61.44 82.9,61.44 83.29,61.04 95.09,61.04 96.68,62.71 96.68,73.5 97.95,74.77 DD15.12
  Bottom 0.254: DD10.17 v65.25,61.44 | DD12.17 v81.76,61.44 81.76,60.01 82.23,59.53 82.23,56.2 82.71,55.72 DD13.18 82.71,49.85 81.44,48.58 DD13.4
PD2  (via drill 0.6)  (2 unrouted)
  Top 0.254: v65.25,62.71 68.42,62.71 68.82,63.1 70.33,63.1 70.64,62.79 70.64,61.91 71.52,61.04 72.55,61.04 74.37,62.87 v83.03,62.87 86.04,62.87 86.28,63.1 94.93,63.1 96.04,64.14 96.04,76.36 97,77.31 DD15.13
  Bottom 0.254: DD10.16 v65.25,62.71 | v83.03,62.87 84.72,62.87 DD12.16
PD3  (via drill 0.6)  (2 unrouted)
  Top 0.254: v65.25,63.98 68.42,63.98 68.82,63.58 70.64,63.58 71.12,63.1 73.18,63.1 73.9,63.82 v81.44,63.82 86.04,63.82 86.28,63.58 92.07,63.58 92.07,77.31 DD15.15
  Bottom 0.254: DD10.15 v65.25,63.98 | DD13.17 81.44,59.21 80.72,59.93 80.72,62.79 v81.44,63.82 84.72,63.82 DD12.15
PD4  (via drill 0.6)  (2 unrouted)
  Top 0.254: v63.98,65.25 64.37,65.25 64.77,65.64 77.47,65.64 77.87,65.25 v83.03,65.25 85.8,65.25 86.28,65.64 91.44,65.64 91.44,75.56 DD15.16
  Bottom 0.2: 80.8,55.64 80.8,49.37
  Bottom 0.254: DD10.14 v63.98,65.25 | DD12.14 v83.03,65.25 81.28,65.25 80.17,64.14 80.17,59.45 80.8,58.82 80.8,55.64 | 80.8,49.37 77.63,46.2 DD13.7
PD5  (via drill 0.6)  (2 unrouted)
  Top 0.254: v65.25,66.52 68.34,66.52 68.74,66.12 72.87,66.12 73.26,66.52 v78.98,66.52 79.3,66.2 v82.15,66.2 86.2,66.2 86.28,66.12 90.8,66.12 90.8,73.66 DD15.17
  Bottom 0.254: DD10.13 v65.25,66.52 | DD13.14 77.63,56.04 78.58,57.15 78.58,65.88 v78.98,66.52 | DD12.13 82.47,66.52 v82.15,66.2
PD6  (via drill 0.6)  (2 unrouted)
  Top 0.254: v63.98,67.79 64.45,67.79 64.85,68.18 70.56,68.18 71.04,68.66 73.66,68.66 74.22,68.1 78.66,68.1 v78.82,68.26 82.39,68.26 v82.63,68.02 85.96,68.02 86.2,68.18 88.82,68.18 89.69,69.06 DD15.19
  Bottom 0.2: 76.99,56.28 76.99,46.67
  Bottom 0.254: DD10.12 v63.98,67.79 | 76.99,56.28 78.03,57.47 78.03,67.55 v78.82,68.26 | 76.99,46.67 76.36,46.04 DD13.8 | DD12.12 83.42,67.79 v82.63,68.02
PD7  (via drill 0.6)  (2 unrouted)
  Top 0.254: v65.25,69.06 68.5,69.06 68.9,68.66 70.17,68.66 70.64,69.14 70.64,70.09 71.28,70.72 72.71,70.72 74.37,69.06 v77.87,69.06 78.18,69.37 v82.95,69.37 84.53,68.66 87.87,68.66 88.42,69.22 88.42,70.96 DD15.18
  Bottom 0.254: DD10.11 v65.25,69.06 | DD13.13 76.36,56.52 77.47,57.78 77.47,68.58 v77.87,69.06 | DD12.11 83.66,69.06 v82.95,69.37
R/!W  (via drill 0.6)  (1 unrouted)
  Top 0.254: DD7.1 86.04,50.48 78.74,50.48 78.42,50.8 76.76,50.8 75.96,50.01 73.02,50.01 72.39,50.64 70.64,50.64 DD6.1 65.56,53.18 39.53,53.18 DD14.27 | v36.04,95.41 v46.2,95.41
  Bottom 0.254: v36.04,95.41 36.04,85.41 34.77,84.14 DD4.34 36.04,81.12 36.04,80.33 34.77,78.42 DD5.34 34.77,60.01 38.58,56.2 DD14.27 | v46.2,95.41 46.2,104.54 SLOT_F.14
SND_IN  (2 unrouted)
SND_OUT  (1 unrouted)
SOUND21  (1 unrouted)
SOUND21_1  (2 unrouted)
SOUND21_2  (2 unrouted)
SOUND26  (1 unrouted)
SOUND26_1  (2 unrouted)
SOUND26_2  (2 unrouted)

### Text on the board
tPlace: A2017NP1